# EAGLE design v7-flex2811_long (EAGLE 7.3.0)

## Sheet 1 of 20
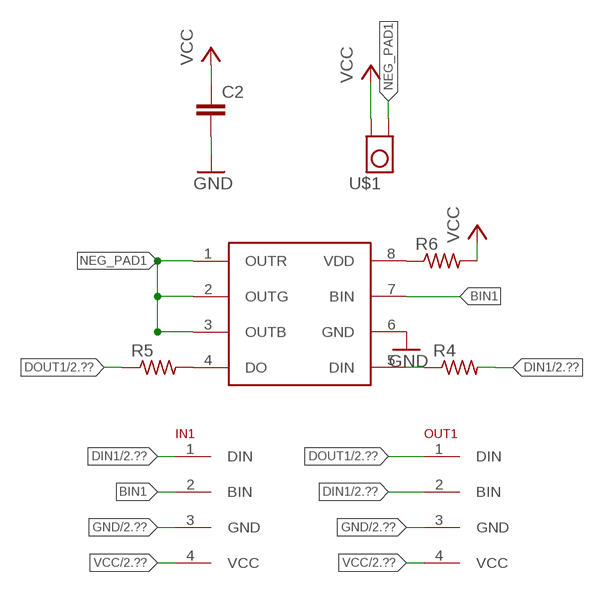
[diagram p0: schematic, sheet 1]

### Parts
C2  C-EUC0201  [C0201]
IN1  4PAD  [4PAD]
OUT1  4PAD  [4PAD]
R4  R-US_R0201  [R0201]
R5  R-US_R0201  [R0201]
R6  R-US_R0201  [R0201]
U$1  TP_4MM_MED_PAD  [TP_4MM_MED_PAD]
U$2  WS2818  [SO08]

### Nets
BIN1: IN1.2(BIN) U$2.7(BIN)
DIN1: IN1.1(DIN) OUT1.2(BIN) R4.2 ; also sheet 2
DOUT1: OUT1.1(DIN) R5.1 ; also sheet 2,3
GND: C2.2 IN1.3(GND) OUT1.3(GND) U$2.6(GND) ; also sheet 2,3,4,5,6,7,8,9,10,11,12,13,14,15,16,17,18,19,20
N$4: R4.1 U$2.5(DIN)
N$5: R5.2 U$2.4(DO)
N$6: R6.1 U$2.8(VDD)
NEG_PAD1: U$1.P$1 U$2.1(OUTR) U$2.2(OUTG) U$2.3(OUTB)
VCC: C2.1 IN1.4(VCC) OUT1.4(VCC) R6.2 U$1.P$2 ; also sheet 2,3,4,5,6,7,8,9,10,11,12,13,14,15,16,17,18,19,20

## Sheet 2 of 20
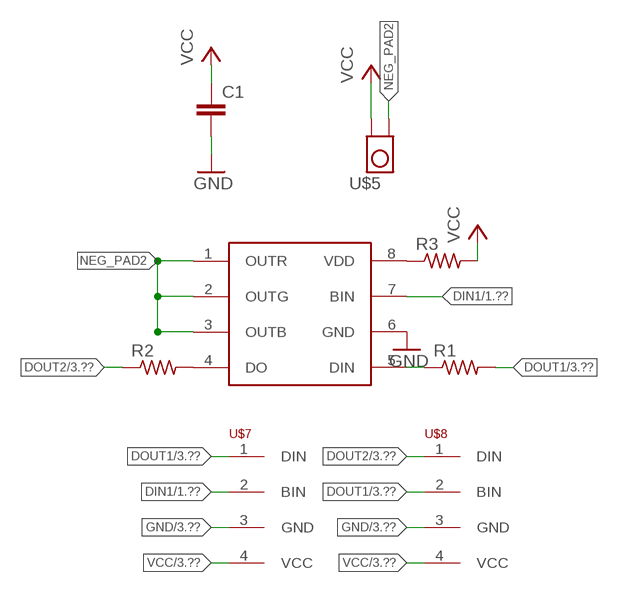
[diagram p1: schematic, sheet 2]

### Parts
C1  C-EUC0201  [C0201]
R1  R-US_R0201  [R0201]
R2  R-US_R0201  [R0201]
R3  R-US_R0201  [R0201]
U$5  TP_4MM_MED_PAD  [TP_4MM_MED_PAD]
U$6  WS2818  [SO08]
U$7  4PAD  [4PAD]
U$8  4PAD  [4PAD]

### Nets
DIN1: U$6.7(BIN) U$7.2(BIN) ; also sheet 1
DOUT1: R1.2 U$7.1(DIN) U$8.2(BIN) ; also sheet 1,3
DOUT2: R2.1 U$8.1(DIN) ; also sheet 3,4
GND: C1.2 U$6.6(GND) U$7.3(GND) U$8.3(GND) ; also sheet 1,3,4,5,6,7,8,9,10,11,12,13,14,15,16,17,18,19,20
N$1: R1.1 U$6.5(DIN)
N$2: R2.2 U$6.4(DO)
N$3: R3.1 U$6.8(VDD)
NEG_PAD2: U$5.P$1 U$6.1(OUTR) U$6.2(OUTG) U$6.3(OUTB)
VCC: C1.1 R3.2 U$5.P$2 U$7.4(VCC) U$8.4(VCC) ; also sheet 1,3,4,5,6,7,8,9,10,11,12,13,14,15,16,17,18,19,20

## Sheet 3 of 20
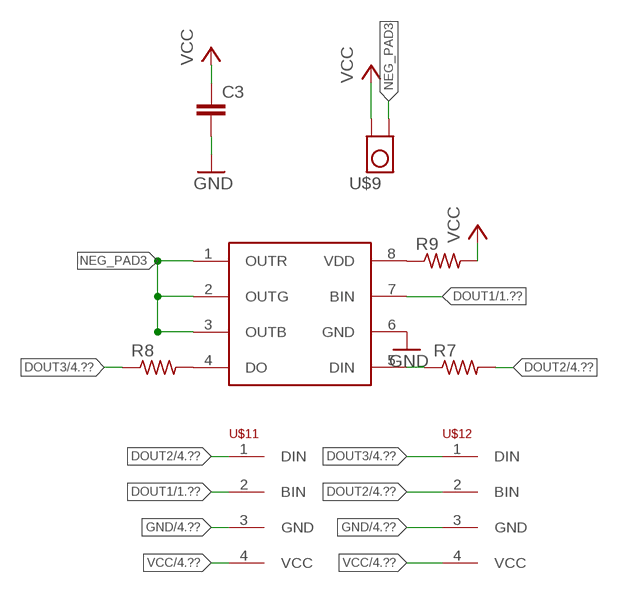
[diagram p2: schematic, sheet 3]

### Parts
C3  C-EUC0201  [C0201]
R7  R-US_R0201  [R0201]
R8  R-US_R0201  [R0201]
R9  R-US_R0201  [R0201]
U$9  TP_4MM_MED_PAD  [TP_4MM_MED_PAD]
U$10  WS2818  [SO08]
U$11  4PAD  [4PAD]
U$12  4PAD  [4PAD]

### Nets
DOUT1: U$10.7(BIN) U$11.2(BIN) ; also sheet 1,2
DOUT2: R7.2 U$11.1(DIN) U$12.2(BIN) ; also sheet 2,4
DOUT3: R8.1 U$12.1(DIN) ; also sheet 4,5
GND: C3.2 U$10.6(GND) U$11.3(GND) U$12.3(GND) ; also sheet 1,2,4,5,6,7,8,9,10,11,12,13,14,15,16,17,18,19,20
N$7: R7.1 U$10.5(DIN)
N$8: R8.2 U$10.4(DO)
N$9: R9.1 U$10.8(VDD)
NEG_PAD3: U$9.P$1 U$10.1(OUTR) U$10.2(OUTG) U$10.3(OUTB)
VCC: C3.1 R9.2 U$9.P$2 U$11.4(VCC) U$12.4(VCC) ; also sheet 1,2,4,5,6,7,8,9,10,11,12,13,14,15,16,17,18,19,20

## Sheet 4 of 20
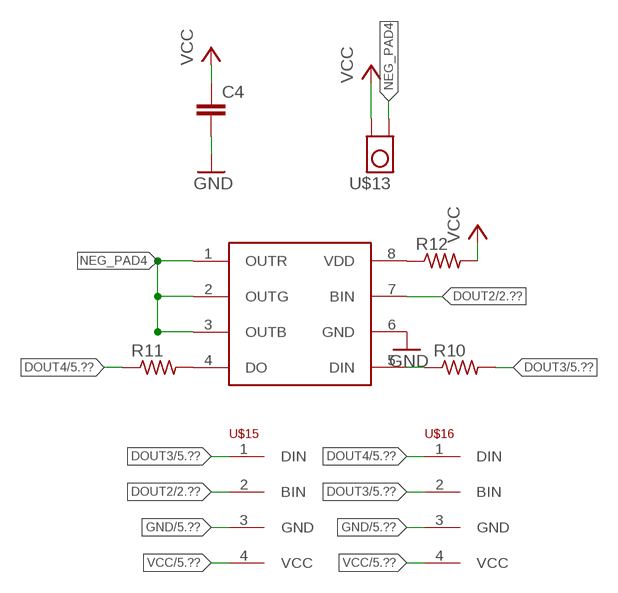
[diagram p3: schematic, sheet 4]

### Parts
C4  C-EUC0201  [C0201]
R10  R-US_R0201  [R0201]
R11  R-US_R0201  [R0201]
R12  R-US_R0201  [R0201]
U$13  TP_4MM_MED_PAD  [TP_4MM_MED_PAD]
U$14  WS2818  [SO08]
U$15  4PAD  [4PAD]
U$16  4PAD  [4PAD]

### Nets
DOUT2: U$14.7(BIN) U$15.2(BIN) ; also sheet 2,3
DOUT3: R10.2 U$15.1(DIN) U$16.2(BIN) ; also sheet 3,5
DOUT4: R11.1 U$16.1(DIN) ; also sheet 5,6
GND: C4.2 U$14.6(GND) U$15.3(GND) U$16.3(GND) ; also sheet 1,2,3,5,6,7,8,9,10,11,12,13,14,15,16,17,18,19,20
N$10: R10.1 U$14.5(DIN)
N$11: R11.2 U$14.4(DO)
N$12: R12.1 U$14.8(VDD)
NEG_PAD4: U$13.P$1 U$14.1(OUTR) U$14.2(OUTG) U$14.3(OUTB)
VCC: C4.1 R12.2 U$13.P$2 U$15.4(VCC) U$16.4(VCC) ; also sheet 1,2,3,5,6,7,8,9,10,11,12,13,14,15,16,17,18,19,20

## Sheet 5 of 20
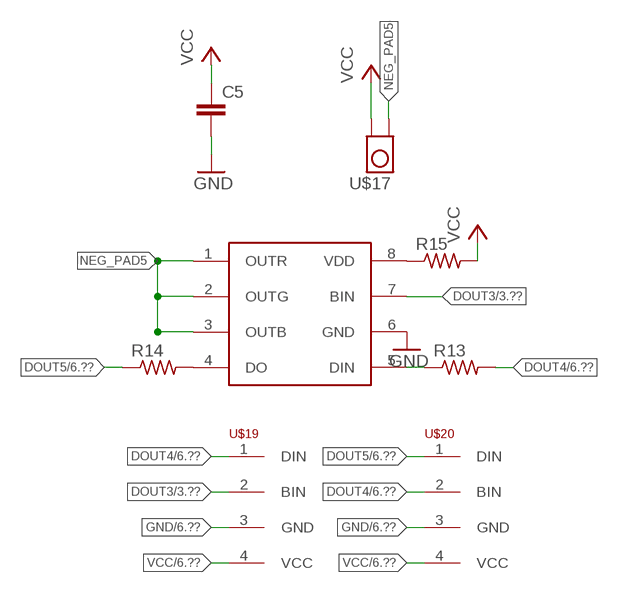
[diagram p4: schematic, sheet 5]

### Parts
C5  C-EUC0201  [C0201]
R13  R-US_R0201  [R0201]
R14  R-US_R0201  [R0201]
R15  R-US_R0201  [R0201]
U$17  TP_4MM_MED_PAD  [TP_4MM_MED_PAD]
U$18  WS2818  [SO08]
U$19  4PAD  [4PAD]
U$20  4PAD  [4PAD]

### Nets
DOUT3: U$18.7(BIN) U$19.2(BIN) ; also sheet 3,4
DOUT4: R13.2 U$19.1(DIN) U$20.2(BIN) ; also sheet 4,6
DOUT5: R14.1 U$20.1(DIN) ; also sheet 6,7
GND: C5.2 U$18.6(GND) U$19.3(GND) U$20.3(GND) ; also sheet 1,2,3,4,6,7,8,9,10,11,12,13,14,15,16,17,18,19,20
N$13: R13.1 U$18.5(DIN)
N$14: R14.2 U$18.4(DO)
N$15: R15.1 U$18.8(VDD)
NEG_PAD5: U$17.P$1 U$18.1(OUTR) U$18.2(OUTG) U$18.3(OUTB)
VCC: C5.1 R15.2 U$17.P$2 U$19.4(VCC) U$20.4(VCC) ; also sheet 1,2,3,4,6,7,8,9,10,11,12,13,14,15,16,17,18,19,20

## Sheet 6 of 20
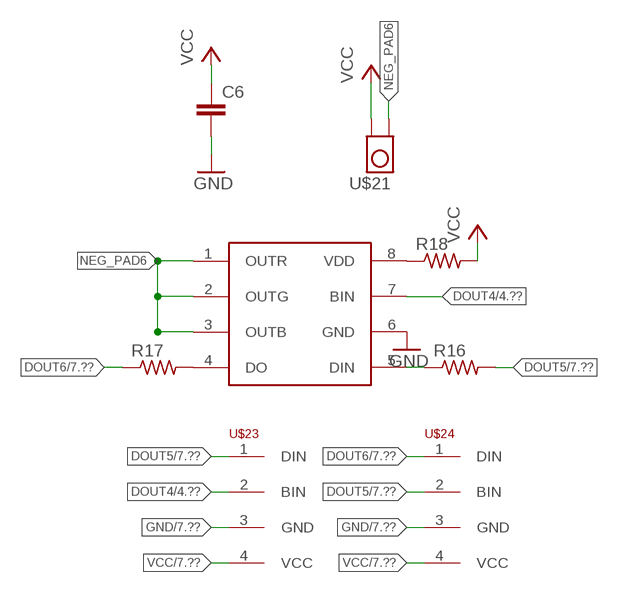
[diagram p5: schematic, sheet 6]

### Parts
C6  C-EUC0201  [C0201]
R16  R-US_R0201  [R0201]
R17  R-US_R0201  [R0201]
R18  R-US_R0201  [R0201]
U$21  TP_4MM_MED_PAD  [TP_4MM_MED_PAD]
U$22  WS2818  [SO08]
U$23  4PAD  [4PAD]
U$24  4PAD  [4PAD]

### Nets
DOUT4: U$22.7(BIN) U$23.2(BIN) ; also sheet 4,5
DOUT5: R16.2 U$23.1(DIN) U$24.2(BIN) ; also sheet 5,7
DOUT6: R17.1 U$24.1(DIN) ; also sheet 7,8
GND: C6.2 U$22.6(GND) U$23.3(GND) U$24.3(GND) ; also sheet 1,2,3,4,5,7,8,9,10,11,12,13,14,15,16,17,18,19,20
N$16: R16.1 U$22.5(DIN)
N$17: R17.2 U$22.4(DO)
N$18: R18.1 U$22.8(VDD)
NEG_PAD6: U$21.P$1 U$22.1(OUTR) U$22.2(OUTG) U$22.3(OUTB)
VCC: C6.1 R18.2 U$21.P$2 U$23.4(VCC) U$24.4(VCC) ; also sheet 1,2,3,4,5,7,8,9,10,11,12,13,14,15,16,17,18,19,20

## Sheet 7 of 20
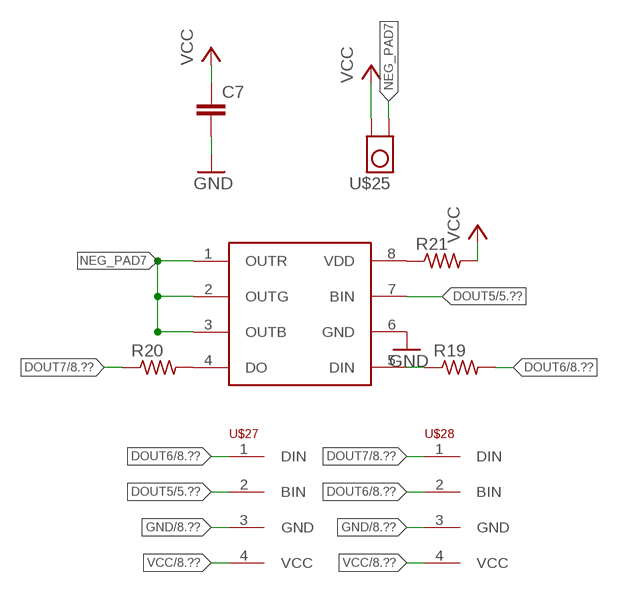
[diagram p6: schematic, sheet 7]

### Parts
C7  C-EUC0201  [C0201]
R19  R-US_R0201  [R0201]
R20  R-US_R0201  [R0201]
R21  R-US_R0201  [R0201]
U$25  TP_4MM_MED_PAD  [TP_4MM_MED_PAD]
U$26  WS2818  [SO08]
U$27  4PAD  [4PAD]
U$28  4PAD  [4PAD]

### Nets
DOUT5: U$26.7(BIN) U$27.2(BIN) ; also sheet 5,6
DOUT6: R19.2 U$27.1(DIN) U$28.2(BIN) ; also sheet 6,8
DOUT7: R20.1 U$28.1(DIN) ; also sheet 8,9
GND: C7.2 U$26.6(GND) U$27.3(GND) U$28.3(GND) ; also sheet 1,2,3,4,5,6,8,9,10,11,12,13,14,15,16,17,18,19,20
N$19: R19.1 U$26.5(DIN)
N$20: R20.2 U$26.4(DO)
N$21: R21.1 U$26.8(VDD)
NEG_PAD7: U$25.P$1 U$26.1(OUTR) U$26.2(OUTG) U$26.3(OUTB)
VCC: C7.1 R21.2 U$25.P$2 U$27.4(VCC) U$28.4(VCC) ; also sheet 1,2,3,4,5,6,8,9,10,11,12,13,14,15,16,17,18,19,20

## Sheet 8 of 20
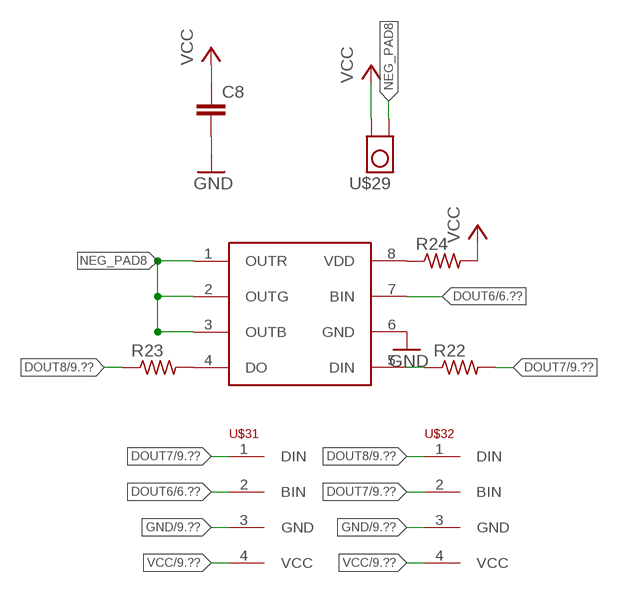
[diagram p7: schematic, sheet 8]

### Parts
C8  C-EUC0201  [C0201]
R22  R-US_R0201  [R0201]
R23  R-US_R0201  [R0201]
R24  R-US_R0201  [R0201]
U$29  TP_4MM_MED_PAD  [TP_4MM_MED_PAD]
U$30  WS2818  [SO08]
U$31  4PAD  [4PAD]
U$32  4PAD  [4PAD]

### Nets
DOUT6: U$30.7(BIN) U$31.2(BIN) ; also sheet 6,7
DOUT7: R22.2 U$31.1(DIN) U$32.2(BIN) ; also sheet 7,9
DOUT8: R23.1 U$32.1(DIN) ; also sheet 9,10
GND: C8.2 U$30.6(GND) U$31.3(GND) U$32.3(GND) ; also sheet 1,2,3,4,5,6,7,9,10,11,12,13,14,15,16,17,18,19,20
N$22: R22.1 U$30.5(DIN)
N$23: R23.2 U$30.4(DO)
N$24: R24.1 U$30.8(VDD)
NEG_PAD8: U$29.P$1 U$30.1(OUTR) U$30.2(OUTG) U$30.3(OUTB)
VCC: C8.1 R24.2 U$29.P$2 U$31.4(VCC) U$32.4(VCC) ; also sheet 1,2,3,4,5,6,7,9,10,11,12,13,14,15,16,17,18,19,20

## Sheet 9 of 20
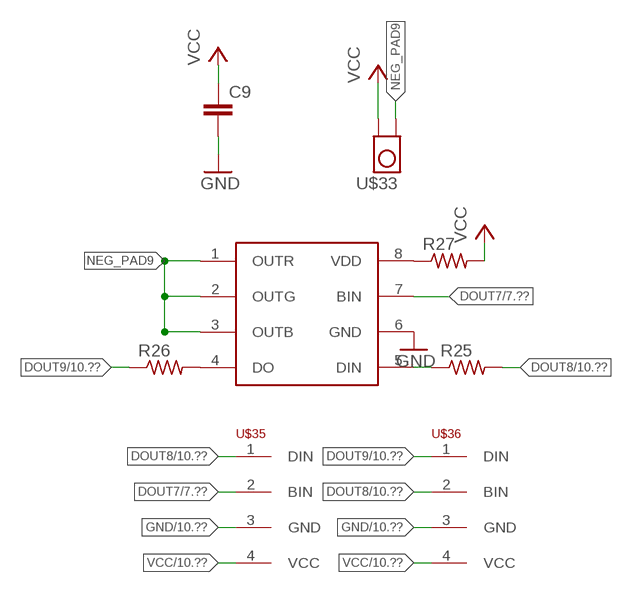
[diagram p8: schematic, sheet 9]

### Parts
C9  C-EUC0201  [C0201]
R25  R-US_R0201  [R0201]
R26  R-US_R0201  [R0201]
R27  R-US_R0201  [R0201]
U$33  TP_4MM_MED_PAD  [TP_4MM_MED_PAD]
U$34  WS2818  [SO08]
U$35  4PAD  [4PAD]
U$36  4PAD  [4PAD]

### Nets
DOUT7: U$34.7(BIN) U$35.2(BIN) ; also sheet 7,8
DOUT8: R25.2 U$35.1(DIN) U$36.2(BIN) ; also sheet 8,10
DOUT9: R26.1 U$36.1(DIN) ; also sheet 10,11
GND: C9.2 U$34.6(GND) U$35.3(GND) U$36.3(GND) ; also sheet 1,2,3,4,5,6,7,8,10,11,12,13,14,15,16,17,18,19,20
N$25: R25.1 U$34.5(DIN)
N$26: R26.2 U$34.4(DO)
N$27: R27.1 U$34.8(VDD)
NEG_PAD9: U$33.P$1 U$34.1(OUTR) U$34.2(OUTG) U$34.3(OUTB)
VCC: C9.1 R27.2 U$33.P$2 U$35.4(VCC) U$36.4(VCC) ; also sheet 1,2,3,4,5,6,7,8,10,11,12,13,14,15,16,17,18,19,20

## Sheet 10 of 20
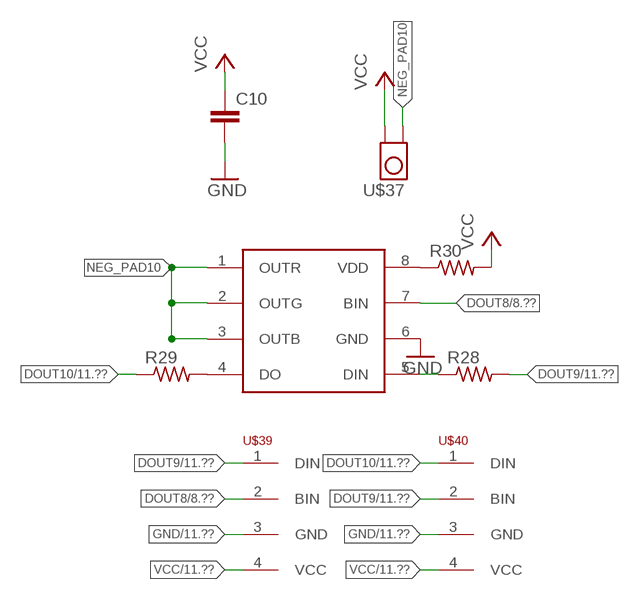
[diagram p9: schematic, sheet 10]

### Parts
C10  C-EUC0201  [C0201]
R28  R-US_R0201  [R0201]
R29  R-US_R0201  [R0201]
R30  R-US_R0201  [R0201]
U$37  TP_4MM_MED_PAD  [TP_4MM_MED_PAD]
U$38  WS2818  [SO08]
U$39  4PAD  [4PAD]
U$40  4PAD  [4PAD]

### Nets
DOUT8: U$38.7(BIN) U$39.2(BIN) ; also sheet 8,9
DOUT9: R28.2 U$39.1(DIN) U$40.2(BIN) ; also sheet 9,11
DOUT10: R29.1 U$40.1(DIN) ; also sheet 11,12
GND: C10.2 U$38.6(GND) U$39.3(GND) U$40.3(GND) ; also sheet 1,2,3,4,5,6,7,8,9,11,12,13,14,15,16,17,18,19,20
N$28: R28.1 U$38.5(DIN)
N$29: R29.2 U$38.4(DO)
N$30: R30.1 U$38.8(VDD)
NEG_PAD10: U$37.P$1 U$38.1(OUTR) U$38.2(OUTG) U$38.3(OUTB)
VCC: C10.1 R30.2 U$37.P$2 U$39.4(VCC) U$40.4(VCC) ; also sheet 1,2,3,4,5,6,7,8,9,11,12,13,14,15,16,17,18,19,20

## Sheet 11 of 20
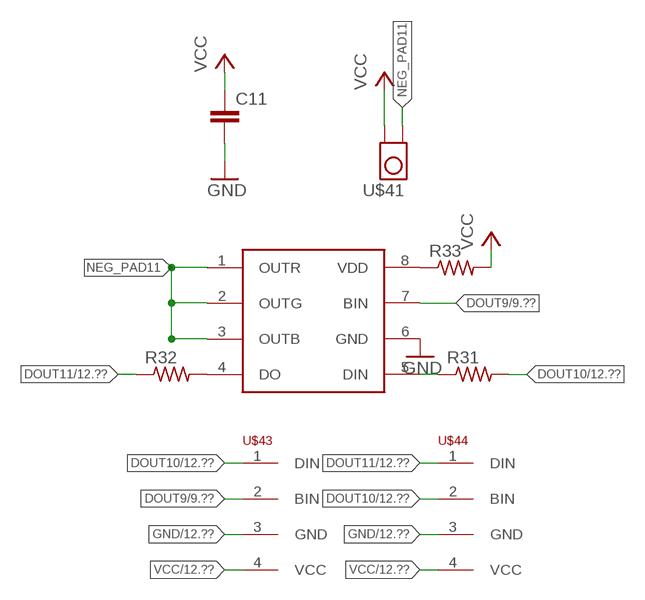
[diagram p10: schematic, sheet 11]

### Parts
C11  C-EUC0201  [C0201]
R31  R-US_R0201  [R0201]
R32  R-US_R0201  [R0201]
R33  R-US_R0201  [R0201]
U$41  TP_4MM_MED_PAD  [TP_4MM_MED_PAD]
U$42  WS2818  [SO08]
U$43  4PAD  [4PAD]
U$44  4PAD  [4PAD]

### Nets
DOUT9: U$42.7(BIN) U$43.2(BIN) ; also sheet 9,10
DOUT10: R31.2 U$43.1(DIN) U$44.2(BIN) ; also sheet 10,12
DOUT11: R32.1 U$44.1(DIN) ; also sheet 12,13
GND: C11.2 U$42.6(GND) U$43.3(GND) U$44.3(GND) ; also sheet 1,2,3,4,5,6,7,8,9,10,12,13,14,15,16,17,18,19,20
N$31: R31.1 U$42.5(DIN)
N$32: R32.2 U$42.4(DO)
N$33: R33.1 U$42.8(VDD)
NEG_PAD11: U$41.P$1 U$42.1(OUTR) U$42.2(OUTG) U$42.3(OUTB)
VCC: C11.1 R33.2 U$41.P$2 U$43.4(VCC) U$44.4(VCC) ; also sheet 1,2,3,4,5,6,7,8,9,10,12,13,14,15,16,17,18,19,20

## Sheet 12 of 20
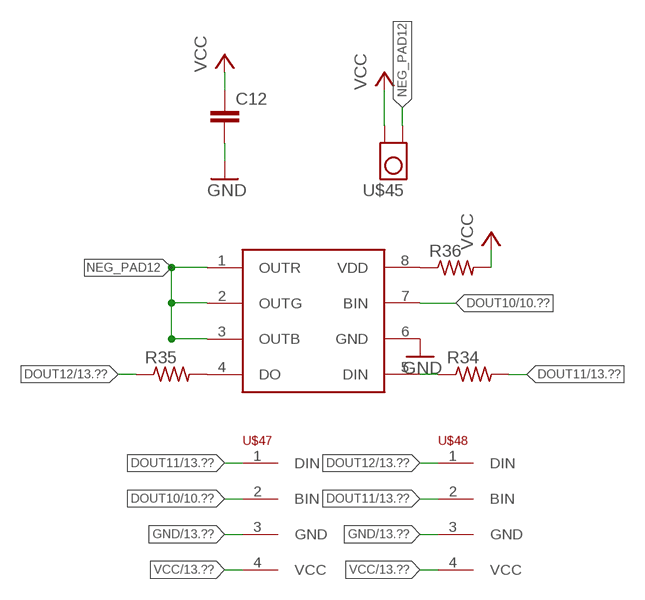
[diagram p11: schematic, sheet 12]

### Parts
C12  C-EUC0201  [C0201]
R34  R-US_R0201  [R0201]
R35  R-US_R0201  [R0201]
R36  R-US_R0201  [R0201]
U$45  TP_4MM_MED_PAD  [TP_4MM_MED_PAD]
U$46  WS2818  [SO08]
U$47  4PAD  [4PAD]
U$48  4PAD  [4PAD]

### Nets
DOUT10: U$46.7(BIN) U$47.2(BIN) ; also sheet 10,11
DOUT11: R34.2 U$47.1(DIN) U$48.2(BIN) ; also sheet 11,13
DOUT12: R35.1 U$48.1(DIN) ; also sheet 13,14
GND: C12.2 U$46.6(GND) U$47.3(GND) U$48.3(GND) ; also sheet 1,2,3,4,5,6,7,8,9,10,11,13,14,15,16,17,18,19,20
N$34: R34.1 U$46.5(DIN)
N$35: R35.2 U$46.4(DO)
N$36: R36.1 U$46.8(VDD)
NEG_PAD12: U$45.P$1 U$46.1(OUTR) U$46.2(OUTG) U$46.3(OUTB)
VCC: C12.1 R36.2 U$45.P$2 U$47.4(VCC) U$48.4(VCC) ; also sheet 1,2,3,4,5,6,7,8,9,10,11,13,14,15,16,17,18,19,20

## Sheet 13 of 20
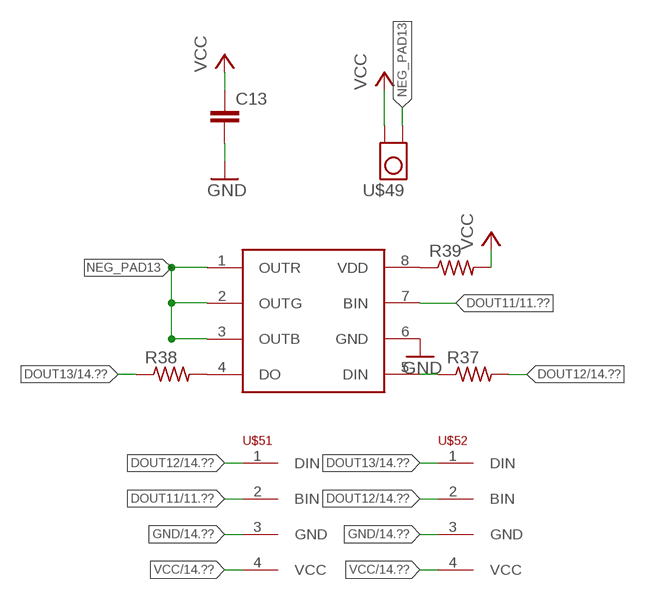
[diagram p12: schematic, sheet 13]

### Parts
C13  C-EUC0201  [C0201]
R37  R-US_R0201  [R0201]
R38  R-US_R0201  [R0201]
R39  R-US_R0201  [R0201]
U$49  TP_4MM_MED_PAD  [TP_4MM_MED_PAD]
U$50  WS2818  [SO08]
U$51  4PAD  [4PAD]
U$52  4PAD  [4PAD]

### Nets
DOUT11: U$50.7(BIN) U$51.2(BIN) ; also sheet 11,12
DOUT12: R37.2 U$51.1(DIN) U$52.2(BIN) ; also sheet 12,14
DOUT13: R38.1 U$52.1(DIN) ; also sheet 14,15
GND: C13.2 U$50.6(GND) U$51.3(GND) U$52.3(GND) ; also sheet 1,2,3,4,5,6,7,8,9,10,11,12,14,15,16,17,18,19,20
N$37: R37.1 U$50.5(DIN)
N$38: R38.2 U$50.4(DO)
N$39: R39.1 U$50.8(VDD)
NEG_PAD13: U$49.P$1 U$50.1(OUTR) U$50.2(OUTG) U$50.3(OUTB)
VCC: C13.1 R39.2 U$49.P$2 U$51.4(VCC) U$52.4(VCC) ; also sheet 1,2,3,4,5,6,7,8,9,10,11,12,14,15,16,17,18,19,20

## Sheet 14 of 20
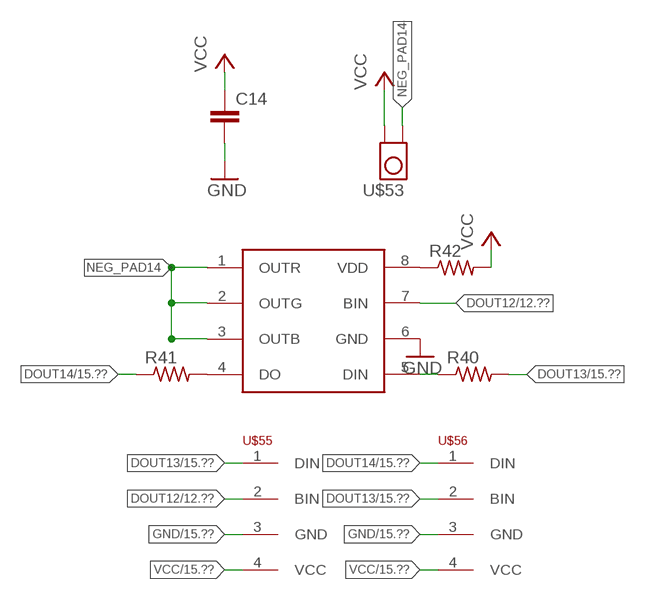
[diagram p13: schematic, sheet 14]

### Parts
C14  C-EUC0201  [C0201]
R40  R-US_R0201  [R0201]
R41  R-US_R0201  [R0201]
R42  R-US_R0201  [R0201]
U$53  TP_4MM_MED_PAD  [TP_4MM_MED_PAD]
U$54  WS2818  [SO08]
U$55  4PAD  [4PAD]
U$56  4PAD  [4PAD]

### Nets
DOUT12: U$54.7(BIN) U$55.2(BIN) ; also sheet 12,13
DOUT13: R40.2 U$55.1(DIN) U$56.2(BIN) ; also sheet 13,15
DOUT14: R41.1 U$56.1(DIN) ; also sheet 15,16
GND: C14.2 U$54.6(GND) U$55.3(GND) U$56.3(GND) ; also sheet 1,2,3,4,5,6,7,8,9,10,11,12,13,15,16,17,18,19,20
N$40: R40.1 U$54.5(DIN)
N$41: R41.2 U$54.4(DO)
N$42: R42.1 U$54.8(VDD)
NEG_PAD14: U$53.P$1 U$54.1(OUTR) U$54.2(OUTG) U$54.3(OUTB)
VCC: C14.1 R42.2 U$53.P$2 U$55.4(VCC) U$56.4(VCC) ; also sheet 1,2,3,4,5,6,7,8,9,10,11,12,13,15,16,17,18,19,20

## Sheet 15 of 20
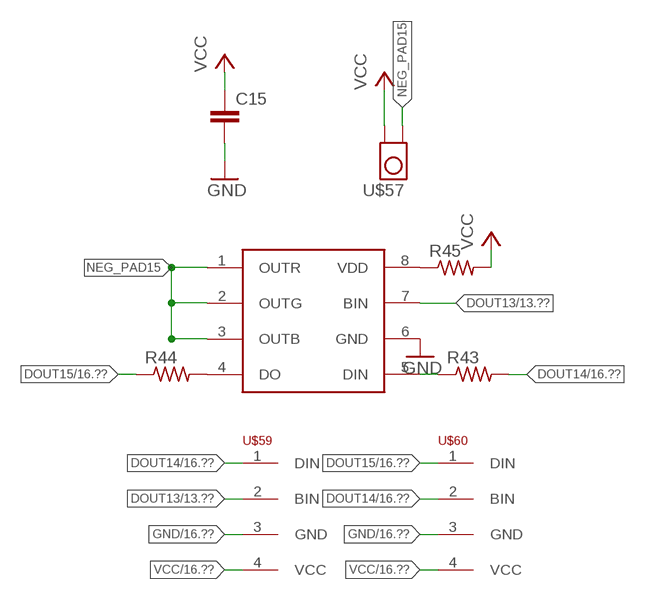
[diagram p14: schematic, sheet 15]

### Parts
C15  C-EUC0201  [C0201]
R43  R-US_R0201  [R0201]
R44  R-US_R0201  [R0201]
R45  R-US_R0201  [R0201]
U$57  TP_4MM_MED_PAD  [TP_4MM_MED_PAD]
U$58  WS2818  [SO08]
U$59  4PAD  [4PAD]
U$60  4PAD  [4PAD]

### Nets
DOUT13: U$58.7(BIN) U$59.2(BIN) ; also sheet 13,14
DOUT14: R43.2 U$59.1(DIN) U$60.2(BIN) ; also sheet 14,16
DOUT15: R44.1 U$60.1(DIN) ; also sheet 16,17
GND: C15.2 U$58.6(GND) U$59.3(GND) U$60.3(GND) ; also sheet 1,2,3,4,5,6,7,8,9,10,11,12,13,14,16,17,18,19,20
N$43: R43.1 U$58.5(DIN)
N$44: R44.2 U$58.4(DO)
N$45: R45.1 U$58.8(VDD)
NEG_PAD15: U$57.P$1 U$58.1(OUTR) U$58.2(OUTG) U$58.3(OUTB)
VCC: C15.1 R45.2 U$57.P$2 U$59.4(VCC) U$60.4(VCC) ; also sheet 1,2,3,4,5,6,7,8,9,10,11,12,13,14,16,17,18,19,20

## Sheet 16 of 20
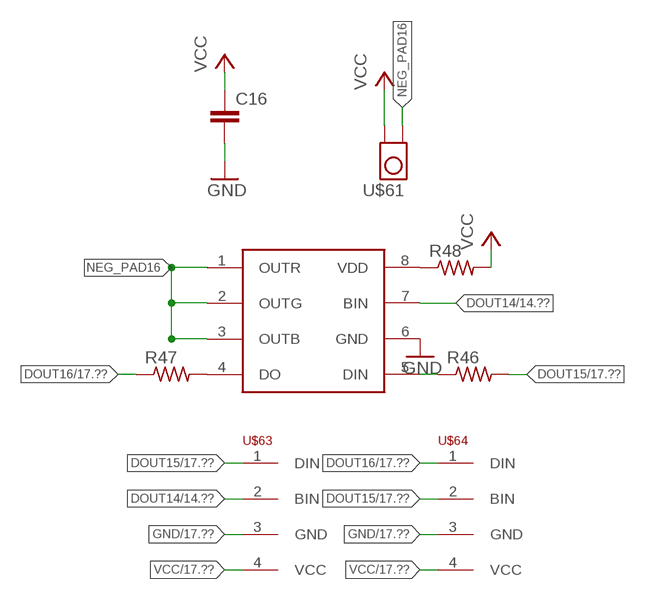
[diagram p15: schematic, sheet 16]

### Parts
C16  C-EUC0201  [C0201]
R46  R-US_R0201  [R0201]
R47  R-US_R0201  [R0201]
R48  R-US_R0201  [R0201]
U$61  TP_4MM_MED_PAD  [TP_4MM_MED_PAD]
U$62  WS2818  [SO08]
U$63  4PAD  [4PAD]
U$64  4PAD  [4PAD]

### Nets
DOUT14: U$62.7(BIN) U$63.2(BIN) ; also sheet 14,15
DOUT15: R46.2 U$63.1(DIN) U$64.2(BIN) ; also sheet 15,17
DOUT16: R47.1 U$64.1(DIN) ; also sheet 17,18
GND: C16.2 U$62.6(GND) U$63.3(GND) U$64.3(GND) ; also sheet 1,2,3,4,5,6,7,8,9,10,11,12,13,14,15,17,18,19,20
N$46: R46.1 U$62.5(DIN)
N$47: R47.2 U$62.4(DO)
N$48: R48.1 U$62.8(VDD)
NEG_PAD16: U$61.P$1 U$62.1(OUTR) U$62.2(OUTG) U$62.3(OUTB)
VCC: C16.1 R48.2 U$61.P$2 U$63.4(VCC) U$64.4(VCC) ; also sheet 1,2,3,4,5,6,7,8,9,10,11,12,13,14,15,17,18,19,20

## Sheet 17 of 20
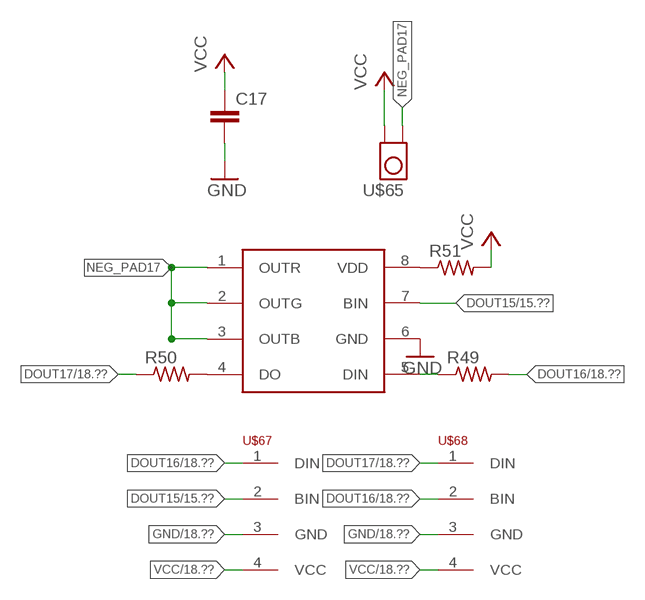
[diagram p16: schematic, sheet 17]

### Parts
C17  C-EUC0201  [C0201]
R49  R-US_R0201  [R0201]
R50  R-US_R0201  [R0201]
R51  R-US_R0201  [R0201]
U$65  TP_4MM_MED_PAD  [TP_4MM_MED_PAD]
U$66  WS2818  [SO08]
U$67  4PAD  [4PAD]
U$68  4PAD  [4PAD]

### Nets
DOUT15: U$66.7(BIN) U$67.2(BIN) ; also sheet 15,16
DOUT16: R49.2 U$67.1(DIN) U$68.2(BIN) ; also sheet 16,18
DOUT17: R50.1 U$68.1(DIN) ; also sheet 18,19
GND: C17.2 U$66.6(GND) U$67.3(GND) U$68.3(GND) ; also sheet 1,2,3,4,5,6,7,8,9,10,11,12,13,14,15,16,18,19,20
N$49: R49.1 U$66.5(DIN)
N$50: R50.2 U$66.4(DO)
N$51: R51.1 U$66.8(VDD)
NEG_PAD17: U$65.P$1 U$66.1(OUTR) U$66.2(OUTG) U$66.3(OUTB)
VCC: C17.1 R51.2 U$65.P$2 U$67.4(VCC) U$68.4(VCC) ; also sheet 1,2,3,4,5,6,7,8,9,10,11,12,13,14,15,16,18,19,20

## Sheet 18 of 20
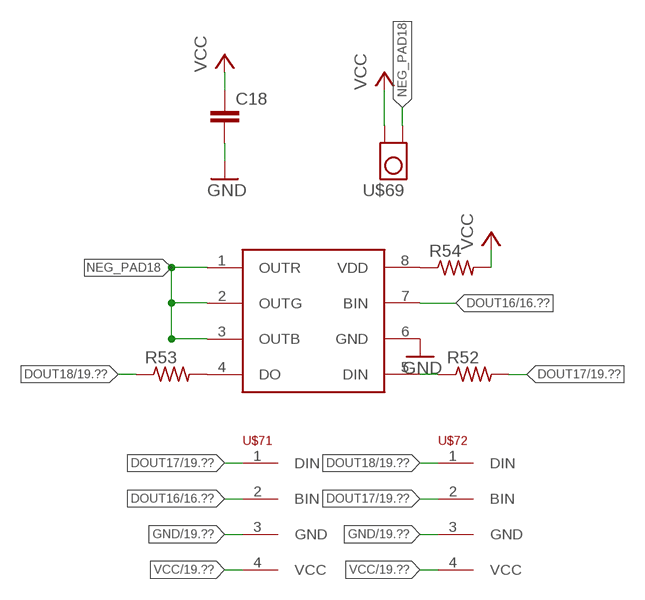
[diagram p17: schematic, sheet 18]

### Parts
C18  C-EUC0201  [C0201]
R52  R-US_R0201  [R0201]
R53  R-US_R0201  [R0201]
R54  R-US_R0201  [R0201]
U$69  TP_4MM_MED_PAD  [TP_4MM_MED_PAD]
U$70  WS2818  [SO08]
U$71  4PAD  [4PAD]
U$72  4PAD  [4PAD]

### Nets
DOUT16: U$70.7(BIN) U$71.2(BIN) ; also sheet 16,17
DOUT17: R52.2 U$71.1(DIN) U$72.2(BIN) ; also sheet 17,19
DOUT18: R53.1 U$72.1(DIN) ; also sheet 19,20
GND: C18.2 U$70.6(GND) U$71.3(GND) U$72.3(GND) ; also sheet 1,2,3,4,5,6,7,8,9,10,11,12,13,14,15,16,17,19,20
N$52: R52.1 U$70.5(DIN)
N$53: R53.2 U$70.4(DO)
N$54: R54.1 U$70.8(VDD)
NEG_PAD18: U$69.P$1 U$70.1(OUTR) U$70.2(OUTG) U$70.3(OUTB)
VCC: C18.1 R54.2 U$69.P$2 U$71.4(VCC) U$72.4(VCC) ; also sheet 1,2,3,4,5,6,7,8,9,10,11,12,13,14,15,16,17,19,20

## Sheet 19 of 20
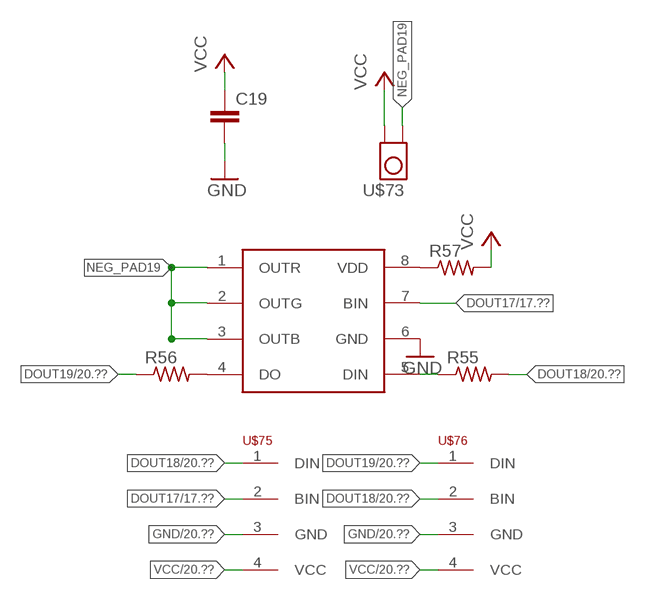
[diagram p18: schematic, sheet 19]

### Parts
C19  C-EUC0201  [C0201]
R55  R-US_R0201  [R0201]
R56  R-US_R0201  [R0201]
R57  R-US_R0201  [R0201]
U$73  TP_4MM_MED_PAD  [TP_4MM_MED_PAD]
U$74  WS2818  [SO08]
U$75  4PAD  [4PAD]
U$76  4PAD  [4PAD]

### Nets
DOUT17: U$74.7(BIN) U$75.2(BIN) ; also sheet 17,18
DOUT18: R55.2 U$75.1(DIN) U$76.2(BIN) ; also sheet 18,20
DOUT19: R56.1 U$76.1(DIN) ; also sheet 20
GND: C19.2 U$74.6(GND) U$75.3(GND) U$76.3(GND) ; also sheet 1,2,3,4,5,6,7,8,9,10,11,12,13,14,15,16,17,18,20
N$55: R55.1 U$74.5(DIN)
N$56: R56.2 U$74.4(DO)
N$57: R57.1 U$74.8(VDD)
NEG_PAD19: U$73.P$1 U$74.1(OUTR) U$74.2(OUTG) U$74.3(OUTB)
VCC: C19.1 R57.2 U$73.P$2 U$75.4(VCC) U$76.4(VCC) ; also sheet 1,2,3,4,5,6,7,8,9,10,11,12,13,14,15,16,17,18,20

## Sheet 20 of 20
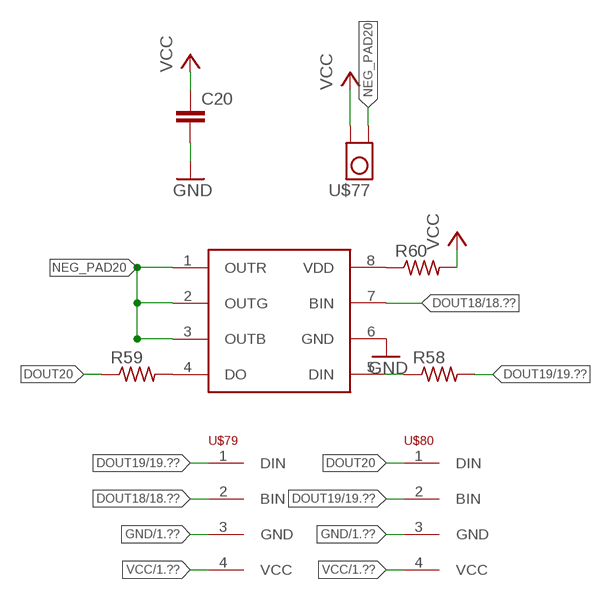
[diagram p19: schematic, sheet 20]

### Parts
C20  C-EUC0201  [C0201]
R58  R-US_R0201  [R0201]
R59  R-US_R0201  [R0201]
R60  R-US_R0201  [R0201]
U$77  TP_4MM_MED_PAD  [TP_4MM_MED_PAD]
U$78  WS2818  [SO08]
U$79  4PAD  [4PAD]
U$80  4PAD  [4PAD]

### Nets
DOUT18: U$78.7(BIN) U$79.2(BIN) ; also sheet 18,19
DOUT19: R58.2 U$79.1(DIN) U$80.2(BIN) ; also sheet 19
DOUT20: R59.1 U$80.1(DIN)
GND: C20.2 U$78.6(GND) U$79.3(GND) U$80.3(GND) ; also sheet 1,2,3,4,5,6,7,8,9,10,11,12,13,14,15,16,17,18,19
N$58: R58.1 U$78.5(DIN)
N$59: R59.2 U$78.4(DO)
N$60: R60.1 U$78.8(VDD)
NEG_PAD20: U$77.P$1 U$78.1(OUTR) U$78.2(OUTG) U$78.3(OUTB)
VCC: C20.1 R60.2 U$77.P$2 U$79.4(VCC) U$80.4(VCC) ; also sheet 1,2,3,4,5,6,7,8,9,10,11,12,13,14,15,16,17,18,19

## Library data of the parts
C1-C20 = rcl:C-EU: CAPACITOR, European symbol
IN1 OUT1 U$7 U$8 U$11 U$12 U$15 U$16 U$19 U$20 U$23 U$24 U$27 U$28 U$31 U$32 U$35 U$36 U$39 U$40 U$43 U$44 U$47 U$48 U$51 U$52 U$55 U$56 U$59 U$60 U$63 U$64 U$67 U$68 U$71 U$72 U$75 U$76 U$79 U$80 = Sparky:4PAD
R1-R60 = rcl:R-US_: RESISTOR, American symbol
U$1 U$5 U$9 U$13 U$17 U$21 U$25 U$29 U$33 U$37 U$41 U$45 U$49 U$53 U$57 U$61 U$65 U$69 U$73 U$77 = tom-tappytap-v5-flex:TP_4MM_MED_PAD
U$2 = Sparky:WS2818
U$6 U$10 U$14 U$18 U$22 U$26 U$30 U$34 U$38 U$42 U$46 U$50 U$54 U$58 U$62 U$66 U$70 U$74 U$78 = adafruit:WS2818

## Board
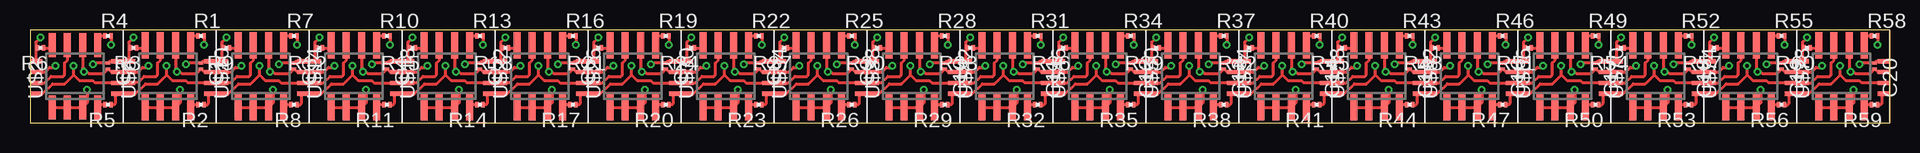
[diagram p20: board, top side]
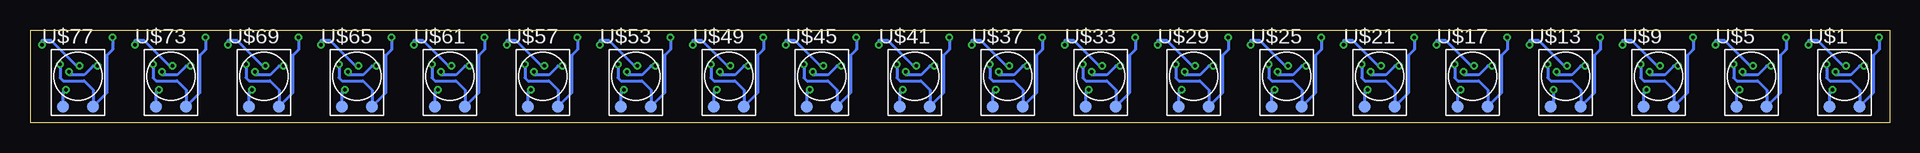
[diagram p21: board, bottom side, seen from below]

Size 155 x 7.75 mm. Coordinates in mm from the lower left corner, seen from the top.
Outline: 0,0 155,0 155,7.75 0,7.75 0,0
Copper layers (1*16): Top 0.035mm / dielectric 1.5mm / Bottom 0.035mm
Design rules "PCBWayMin *": minimum track width 6mil, minimum drill 0.3mm, track to track 6mil, track to pad 6mil, pad to pad 6mil, via to via 6mil, smd to smd 0mil, copper to edge 10mil, drill to drill 8mil, minimum pad ring 10mil, minimum via ring 6mil, stop-mask expansion 4mil, vias tented up to drill 25mil, thermal gap 10mil

### Footprints (pad centres in the part's own frame; a part is rotated, then mirrored left to right if it is on the bottom)
C0201 = smd 0.25 x 0.35: 1 -0.25,0; 2 0.25,0
4PAD = smd 1 x 0.4: 1 0,0.3 | smd 1 x 0.35: 2 0,1.2; 3 0,2.1; 4 0,3
R0201 = smd 0.28 x 0.43: 1 -0.255,0; 2 0.255,0
TP_4MM_MED_PAD = smd 1.016 x 1.016: P$1 -1.24,-2.55; P$2 1.24,-2.55
SO08 = smd 0.6 x 2: 1 -1.905,-2.6; 2 -0.635,-2.6; 3 0.635,-2.6; 4 1.905,-2.6; 5 1.905,2.6; 6 0.635,2.6; 7 -0.635,2.6; 8 -1.905,2.6
SO08' = smd 0.6 x 2.2: 1 -1.905,-2.6; 2 -0.635,-2.6; 3 0.635,-2.6; 4 1.905,-2.6; 5 1.905,2.6; 6 0.635,2.6; 7 -0.635,2.6; 8 -1.905,2.6

### Placement (x,y rotation side)
C1  14.25,4.75 270 top
C2  6.5,4.75 270 top
C3  22,4.75 270 top
C4  29.75,4.75 270 top
C5  37.5,4.75 270 top
C6  45.25,4.75 270 top
C7  53,4.75 270 top
C8  60.75,4.75 270 top
C9  68.5,4.75 270 top
C10  76.25,4.75 270 top
C11  84,4.75 270 top
C12  91.75,4.75 270 top
C13  99.5,4.75 270 top
C14  107.25,4.75 270 top
C15  115,4.75 270 top
C16  122.75,4.75 270 top
C17  130.5,4.75 270 top
C18  138.25,4.75 270 top
C19  146,4.75 270 top
C20  153.75,4.75 270 top
IN1  0.5,2.12 0 top
OUT1  7.25,2.12 0 top
R1  14.25,7.25 0 top
R2  14.25,1.5 180 top
R3  8.62,6.25 180 top
R4  6.5,7.25 0 top
R5  6.5,1.5 180 top
R6  0.88,6.25 180 top
R7  22,7.25 0 top
R8  22,1.5 180 top
R9  16.38,6.25 180 top
R10  29.75,7.25 0 top
R11  29.75,1.5 180 top
R12  24.12,6.25 180 top
R13  37.5,7.25 0 top
R14  37.5,1.5 180 top
R15  31.88,6.25 180 top
R16  45.25,7.25 0 top
R17  45.25,1.5 180 top
R18  39.62,6.25 180 top
R19  53,7.25 0 top
R20  53,1.5 180 top
R21  47.38,6.25 180 top
R22  60.75,7.25 0 top
R23  60.75,1.5 180 top
R24  55.12,6.25 180 top
R25  68.5,7.25 0 top
R26  68.5,1.5 180 top
R27  62.88,6.25 180 top
R28  76.25,7.25 0 top
R29  76.25,1.5 180 top
R30  70.62,6.25 180 top
R31  84,7.25 0 top
R32  84,1.5 180 top
R33  78.38,6.25 180 top
R34  91.75,7.25 0 top
R35  91.75,1.5 180 top
R36  86.12,6.25 180 top
R37  99.5,7.25 0 top
R38  99.5,1.5 180 top
R39  93.88,6.25 180 top
R40  107.25,7.25 0 top
R41  107.25,1.5 180 top
R42  101.62,6.25 180 top
R43  115,7.25 0 top
R44  115,1.5 180 top
R45  109.38,6.25 180 top
R46  122.75,7.25 0 top
R47  122.75,1.5 180 top
R48  117.12,6.25 180 top
R49  130.5,7.25 0 top
R50  130.5,1.5 180 top
R51  124.88,6.25 180 top
R52  138.25,7.25 0 top
R53  138.25,1.5 180 top
R54  132.62,6.25 180 top
R55  146,7.25 0 top
R56  146,1.5 180 top
R57  140.38,6.25 180 top
R58  153.75,7.25 0 top
R59  153.75,1.5 180 top
R60  148.12,6.25 180 top
U$1  3.75,3.88 0 bottom
U$2  3.75,3.88 0 top
U$5  11.5,3.88 0 bottom
U$6  WS2818  [SO08']  11.5,3.88 0 top
U$7  8.25,2.12 0 top
U$8  15,2.12 0 top
U$9  19.25,3.88 0 bottom
U$10  WS2818  [SO08']  19.25,3.88 0 top
U$11  16,2.12 0 top
U$12  22.75,2.12 0 top
U$13  27,3.88 0 bottom
U$14  WS2818  [SO08']  27,3.88 0 top
U$15  23.75,2.12 0 top
U$16  30.5,2.12 0 top
U$17  34.75,3.88 0 bottom
U$18  WS2818  [SO08']  34.75,3.88 0 top
U$19  31.5,2.12 0 top
U$20  38.25,2.12 0 top
U$21  42.5,3.88 0 bottom
U$22  WS2818  [SO08']  42.5,3.88 0 top
U$23  39.25,2.12 0 top
U$24  46,2.12 0 top
U$25  50.25,3.88 0 bottom
U$26  WS2818  [SO08']  50.25,3.88 0 top
U$27  47,2.12 0 top
U$28  53.75,2.12 0 top
U$29  58,3.88 0 bottom
U$30  WS2818  [SO08']  58,3.88 0 top
U$31  54.75,2.12 0 top
U$32  61.5,2.12 0 top
U$33  65.75,3.88 0 bottom
U$34  WS2818  [SO08']  65.75,3.88 0 top
U$35  62.5,2.12 0 top
U$36  69.25,2.12 0 top
U$37  73.5,3.88 0 bottom
U$38  WS2818  [SO08']  73.5,3.88 0 top
U$39  70.25,2.12 0 top
U$40  77,2.12 0 top
U$41  81.25,3.88 0 bottom
U$42  WS2818  [SO08']  81.25,3.88 0 top
U$43  78,2.12 0 top
U$44  84.75,2.12 0 top
U$45  89,3.88 0 bottom
U$46  WS2818  [SO08']  89,3.88 0 top
U$47  85.75,2.12 0 top
U$48  92.5,2.12 0 top
U$49  96.75,3.88 0 bottom
U$50  WS2818  [SO08']  96.75,3.88 0 top
U$51  93.5,2.12 0 top
U$52  100.25,2.12 0 top
U$53  104.5,3.88 0 bottom
U$54  WS2818  [SO08']  104.5,3.88 0 top
U$55  101.25,2.12 0 top
U$56  108,2.12 0 top
U$57  112.25,3.88 0 bottom
U$58  WS2818  [SO08']  112.25,3.88 0 top
U$59  109,2.12 0 top
U$60  115.75,2.12 0 top
U$61  120,3.88 0 bottom
U$62  WS2818  [SO08']  120,3.88 0 top
U$63  116.75,2.12 0 top
U$64  123.5,2.12 0 top
U$65  127.75,3.88 0 bottom
U$66  WS2818  [SO08']  127.75,3.88 0 top
U$67  124.5,2.12 0 top
U$68  131.25,2.12 0 top
U$69  135.5,3.88 0 bottom
U$70  WS2818  [SO08']  135.5,3.88 0 top
U$71  132.25,2.12 0 top
U$72  139,2.12 0 top
U$73  143.25,3.88 0 bottom
U$74  WS2818  [SO08']  143.25,3.88 0 top
U$75  140,2.12 0 top
U$76  146.75,2.12 0 top
U$77  151,3.88 0 bottom
U$78  WS2818  [SO08']  151,3.88 0 top
U$79  147.75,2.12 0 top
U$80  154.5,2.12 0 top

### Tracks (layer width: path | path; a pad name or v marks a point on that pad's centre or on a via)
BIN1
  Top 0.254: IN1.2 1.2,3.33 1.75,3.88 2.75,3.88 2.88,4 2.88,5 3.12,5.25 U$2.7
DIN1  (via drill 0.3)
  Top 0.254: 3.62,4 v3.62,4.75 | 3.62,4 2.88,3.25 1.88,3.25 1.05,2.42 IN1.1 | 3.62,4 4.12,3.5 5.25,3.5 5.42,3.33 OUT1.2 U$7.2 8.3,3.38 9,3.38 9.5,3.88 10.5,3.88 10.62,4 10.62,5 10.88,5.25 U$6.7 | R4.2 v6.75,6.5
  Bottom 0.254: v3.62,4.75 3.88,4.75 6,6.88 6.75,6.88 v6.75,6.5
DOUT1  (via drill 0.3)
  Top 0.254: 11.38,4 v11.38,4.75 | 11.38,4 10.62,3.25 9.62,3.25 8.8,2.42 U$7.1 OUT1.1 7.12,2.3 7.12,1.62 7,1.5 R5.1 | 11.38,4 11.88,3.5 13,3.5 13.18,3.33 U$8.2 U$11.2 16.7,3.33 17.25,3.88 18.25,3.88 18.38,4 18.38,5 18.62,5.25 18.62,6.46 U$10.7 | R1.2 v14.51,6.5 v14.5,6.5
  Bottom 0.254: v11.38,4.75 11.62,4.75 13.75,6.88 14.5,6.88 v14.5,6.5
DOUT2  (via drill 0.3)
  Top 0.254: R2.1 14.75,1.5 14.88,1.62 14.88,2.3 U$8.1 U$11.1 16.55,2.42 17.38,3.25 18.38,3.25 19.12,4 | 19.12,4 v19.12,4.75 | R7.2 v22.25,6.5 | 19.12,4 19.62,3.5 20.75,3.5 20.93,3.33 U$12.2 U$15.2 24.45,3.33 25,3.88 26,3.88 26.12,4 26.12,5 26.38,5.25 26.38,6.46 U$14.7
  Bottom 0.254: v19.12,4.75 19.38,4.75 21.5,6.88 22.25,6.88 v22.25,6.5
DOUT3  (via drill 0.3)
  Top 0.254: 26.88,4 v26.88,4.75 | 26.88,4 26.12,3.25 25.12,3.25 24.3,2.42 U$15.1 U$12.1 22.62,2.3 22.62,1.62 22.5,1.5 R8.1 | 26.88,4 27.38,3.5 28.5,3.5 28.68,3.33 U$16.2 U$19.2 32.2,3.33 32.75,3.88 33.75,3.88 33.88,4 33.88,5 34.12,5.25 U$18.7 | R10.2 v30,6.5
  Bottom 0.254: v26.88,4.75 27.12,4.75 29.25,6.88 30,6.88 v30,6.5
DOUT4  (via drill 0.3)
  Top 0.254: 34.62,4 v34.62,4.75 | 34.62,4 33.88,3.25 32.88,3.25 32.05,2.42 U$19.1 U$16.1 30.38,2.3 30.38,1.62 30.25,1.5 R11.1 | 34.62,4 35.12,3.5 36.25,3.5 36.42,3.33 U$20.2 U$23.2 39.95,3.33 40.5,3.88 41.5,3.88 41.62,4 41.62,5 41.88,5.25 U$22.7 | R13.2 v37.76,6.5 v37.75,6.5
  Bottom 0.254: v34.62,4.75 34.88,4.75 37,6.88 37.75,6.88 v37.75,6.5
DOUT5  (via drill 0.3)
  Top 0.254: R14.1 38,1.5 38.12,1.62 38.12,2.3 U$20.1 U$23.1 39.8,2.42 40.62,3.25 41.62,3.25 42.38,4 | 42.38,4 v42.38,4.75 | R16.2 v45.51,6.5 v45.5,6.5 | 42.38,4 42.88,3.5 44,3.5 44.17,3.33 U$24.2 U$27.2 47.7,3.33 48.25,3.88 49.25,3.88 49.38,4 49.38,5 49.62,5.25 U$26.7
  Bottom 0.254: v42.38,4.75 42.62,4.75 44.75,6.88 45.5,6.88 v45.5,6.5
DOUT6  (via drill 0.3)
  Top 0.254: 50.12,4 v50.12,4.75 | R19.2 v53.26,6.5 v53.25,6.5 | 50.12,4 49.38,3.25 48.38,3.25 47.55,2.42 U$27.1 U$24.1 45.88,2.3 45.88,1.62 45.75,1.5 R17.1 | 50.12,4 50.62,3.5 51.75,3.5 51.92,3.33 U$28.2 U$31.2 55.45,3.33 56,3.88 57,3.88 57.12,4 57.12,5 57.38,5.25 U$30.7
  Bottom 0.254: v50.12,4.75 50.38,4.75 52.5,6.88 53.25,6.88 v53.25,6.5
DOUT7  (via drill 0.3)
  Top 0.254: 57.88,4 v57.88,4.75 | R22.2 v61.01,6.5 v61,6.5 | 57.88,4 57.12,3.25 56.12,3.25 55.3,2.42 U$31.1 U$28.1 53.62,2.3 53.62,1.62 53.5,1.5 R20.1 | 57.88,4 58.38,3.5 59.5,3.5 59.67,3.33 U$32.2 U$35.2 63.2,3.33 63.75,3.88 64.75,3.88 64.88,4 64.88,5 65.12,5.25 65.12,6.46 U$34.7
  Bottom 0.254: v57.88,4.75 58.12,4.75 60.25,6.88 61,6.88 v61,6.5
DOUT8  (via drill 0.3)
  Top 0.254: U$38.7 72.88,6.46 72.88,5.25 72.62,5 72.62,4 72.5,3.88 71.5,3.88 70.95,3.33 U$39.2 U$36.2 67.42,3.33 67.25,3.5 66.12,3.5 65.62,4 | 65.62,4 v65.62,4.75 | 65.62,4 64.88,3.25 63.88,3.25 63.05,2.42 U$35.1 U$32.1 61.38,2.3 61.38,1.62 61.25,1.5 R23.1 | R25.2 v68.75,6.5
  Bottom 0.254: v65.62,4.75 65.88,4.75 68,6.88 68.75,6.88 v68.75,6.5
DOUT9  (via drill 0.3)
  Top 0.254: 73.38,4 v73.38,4.75 | 73.38,4 72.62,3.25 71.62,3.25 70.8,2.42 U$39.1 U$36.1 69.12,2.3 69.12,1.62 69,1.5 R26.1 | 73.38,4 73.88,3.5 75,3.5 75.17,3.33 U$40.2 U$43.2 78.7,3.33 79.25,3.88 80.25,3.88 80.38,4 80.38,5 80.62,5.25 80.62,6.46 U$42.7 | R28.2 v76.5,6.5
  Bottom 0.254: v73.38,4.75 73.62,4.75 75.75,6.88 76.5,6.88 v76.5,6.5
DOUT10  (via drill 0.3)
  Top 0.254: R29.1 76.75,1.5 76.88,1.62 76.88,2.3 U$40.1 U$43.1 78.55,2.42 79.38,3.25 80.38,3.25 81.12,4 | 81.12,4 v81.12,4.75 | 81.12,4 81.62,3.5 82.75,3.5 82.92,3.33 U$44.2 U$47.2 86.45,3.33 87,3.88 88,3.88 88.12,4 88.12,5 88.38,5.25 88.38,6.46 U$46.7 | R31.2 v84.25,6.5
  Bottom 0.254: v81.12,4.75 81.38,4.75 83.5,6.88 84.25,6.88 v84.25,6.5
DOUT11  (via drill 0.3)
  Top 0.254: 88.88,4 v88.88,4.75 | 88.88,4 88.12,3.25 87.12,3.25 86.3,2.42 U$47.1 U$44.1 84.62,2.3 84.62,1.62 84.5,1.5 R32.1 | 88.88,4 89.38,3.5 90.5,3.5 90.67,3.33 U$48.2 U$51.2 94.2,3.33 94.75,3.88 95.75,3.88 95.88,4 95.88,5 96.12,5.25 96.12,6.46 U$50.7 | R34.2 v92,6.5
  Bottom 0.254: v88.88,4.75 89.12,4.75 91.25,6.88 92,6.88 v92,6.5
DOUT12  (via drill 0.3)
  Top 0.254: 96.62,4 v96.62,4.75 | 96.62,4 95.88,3.25 94.88,3.25 94.05,2.42 U$51.1 U$48.1 92.38,2.3 92.38,1.62 92.25,1.5 R35.1 | 96.62,4 97.12,3.5 98.25,3.5 98.42,3.33 U$52.2 U$55.2 101.95,3.33 102.5,3.88 103.5,3.88 103.62,4 103.62,5 103.88,5.25 103.88,6.46 U$54.7 | R37.2 v99.75,6.5
  Bottom 0.254: v96.62,4.75 96.88,4.75 99,6.88 99.75,6.88 v99.75,6.5
DOUT13  (via drill 0.3)
  Top 0.254: 104.38,4 v104.38,4.75 | 104.38,4 103.62,3.25 102.62,3.25 101.8,2.42 U$55.1 U$52.1 100.12,2.3 100.12,1.62 100,1.5 R38.1 | 104.38,4 104.88,3.5 106,3.5 106.17,3.33 U$56.2 U$59.2 109.7,3.33 110.25,3.88 111.25,3.88 111.38,4 111.38,5 111.62,5.25 111.62,6.46 U$58.7 | R40.2 v107.5,6.5
  Bottom 0.254: v104.38,4.75 104.62,4.75 106.75,6.88 107.5,6.88 v107.5,6.5
DOUT14  (via drill 0.3)
  Top 0.254: 112.12,4 v112.12,4.75 | 112.12,4 111.38,3.25 110.38,3.25 109.55,2.42 U$59.1 U$56.1 107.88,2.3 107.88,1.62 107.75,1.5 R41.1 | 112.12,4 112.62,3.5 113.75,3.5 113.92,3.33 U$60.2 U$63.2 117.45,3.33 118,3.88 119,3.88 119.12,4 119.12,5 119.38,5.25 119.38,6.46 U$62.7 | R43.2 v115.25,6.5
  Bottom 0.254: v112.12,4.75 112.38,4.75 114.5,6.88 115.25,6.88 v115.25,6.5
DOUT15  (via drill 0.3)
  Top 0.254: 119.88,4 v119.88,4.75 | 119.88,4 119.12,3.25 118.12,3.25 117.3,2.42 U$63.1 U$60.1 115.62,2.3 115.62,1.62 115.5,1.5 R44.1 | 119.88,4 120.38,3.5 121.5,3.5 121.67,3.33 U$64.2 U$67.2 125.2,3.33 125.75,3.88 126.75,3.88 126.88,4 126.88,5 127.12,5.25 127.12,6.46 U$66.7 | R46.2 v123,6.5
  Bottom 0.254: v119.88,4.75 120.12,4.75 122.25,6.88 123,6.88 v123,6.5
DOUT16  (via drill 0.3)
  Top 0.254: 127.62,4 v127.62,4.75 | 127.62,4 126.88,3.25 125.88,3.25 125.05,2.42 U$67.1 U$64.1 123.38,2.3 123.38,1.62 123.25,1.5 R47.1 | 127.62,4 128.12,3.5 129.25,3.5 129.43,3.33 U$68.2 U$71.2 132.95,3.33 133.5,3.88 134.5,3.88 134.62,4 134.62,5 134.88,5.25 U$70.7 | R49.2 v130.75,6.5
  Bottom 0.254: v127.62,4.75 127.88,4.75 130,6.88 130.75,6.88 v130.75,6.5
DOUT17  (via drill 0.3)
  Top 0.254: 135.38,4 v135.38,4.75 | 135.38,4 134.62,3.25 133.62,3.25 132.8,2.42 U$71.1 U$68.1 131.12,2.3 131.12,1.62 131,1.5 R50.1 | 135.38,4 135.88,3.5 137,3.5 137.18,3.33 U$72.2 U$75.2 140.7,3.33 141.25,3.88 142.25,3.88 142.38,4 142.38,5 142.62,5.25 U$74.7 | R52.2 v138.5,6.5
  Bottom 0.254: v135.38,4.75 135.62,4.75 137.75,6.88 138.5,6.88 v138.5,6.5
DOUT18  (via drill 0.3)
  Top 0.254: 143.12,4 v143.12,4.75 | 143.12,4 142.38,3.25 141.38,3.25 140.55,2.42 U$75.1 U$72.1 138.88,2.3 138.88,1.62 138.75,1.5 R53.1 | 143.12,4 143.62,3.5 144.75,3.5 144.93,3.33 U$76.2 U$79.2 148.45,3.33 149,3.88 150,3.88 150.12,4 150.12,5 150.38,5.25 U$78.7 | R55.2 v146.25,6.5
  Bottom 0.254: v143.12,4.75 143.38,4.75 145.5,6.88 146.25,6.88 v146.25,6.5
DOUT19  (via drill 0.3)
  Top 0.254: 150.88,4 v150.88,4.75 | 150.88,4 150.12,3.25 149.12,3.25 148.3,2.42 U$79.1 U$76.1 146.62,2.3 146.62,1.62 146.5,1.5 R56.1 | 150.88,4 151.38,3.5 152.5,3.5 152.68,3.33 U$80.2 | R58.2 v154,6.5
  Bottom 0.254: v150.88,4.75 151.12,4.75 153.25,6.88 154,6.88 v154,6.5
DOUT20
  Top 0.254: U$80.1 154.38,2.3 154.38,1.62 154.25,1.5 R59.1
GND  (via drill 0.3)
  Top 0.254: U$2.6 4.38,4.37 v4.5,4.25 4.75,4.25 4.88,4.12 6.12,4.12 C2.2 6.78,4.22 OUT1.3 | IN1.3 0.85,4.22 0.88,4.25 1.25,4.25 1.62,4.62 2,4.62 v2.12,4.75 | 7.22,4.25 OUT1.3 | U$6.6 12.13,4.37 v12.25,4.25 12.5,4.25 12.62,4.12 13.88,4.12 C1.2 14.53,4.22 U$8.3 | 14.97,4.25 U$8.3 | v9.88,4.75 9.75,4.62 9.38,4.62 9,4.25 8.62,4.25 8.6,4.22 U$7.3 OUT1.3 | U$10.6 19.89,4.37 v20,4.25 20.25,4.25 20.38,4.12 21.62,4.12 C3.2 22.27,4.22 U$12.3 | 22.73,4.25 U$12.3 | v17.62,4.75 17.5,4.62 17.12,4.62 16.75,4.25 16.38,4.25 16.35,4.22 U$11.3 U$8.3 | U$14.6 27.64,4.37 v27.75,4.25 28,4.25 28.12,4.12 29.38,4.12 C4.2 30.02,4.22 U$16.3 | 30.48,4.25 U$16.3 | v25.38,4.75 25.25,4.62 24.88,4.62 24.5,4.25 24.12,4.25 24.1,4.22 U$15.3 U$12.3 | U$18.6 35.38,4.37 v35.5,4.25 35.75,4.25 35.88,4.12 37.12,4.12 C5.2 37.77,4.22 U$20.3 | 38.23,4.25 U$20.3 | v33.12,4.75 33,4.62 32.62,4.62 32.25,4.25 31.88,4.25 31.85,4.22 U$19.3 U$16.3 | U$22.6 43.13,4.37 v43.25,4.25 43.5,4.25 43.62,4.12 44.88,4.12 C6.2 45.52,4.22 U$24.3 | 45.98,4.25 U$24.3 | v40.88,4.75 40.75,4.62 40.38,4.62 40,4.25 39.62,4.25 39.6,4.22 U$23.3 U$20.3 | U$26.6 50.88,4.37 v51,4.25 51.25,4.25 51.38,4.12 52.62,4.12 C7.2 53.27,4.22 U$28.3 | 53.73,4.25 U$28.3 | v48.62,4.75 48.5,4.62 48.12,4.62 47.75,4.25 47.38,4.25 47.35,4.22 U$27.3 U$24.3 | U$30.6 58.63,4.37 v58.75,4.25 59,4.25 59.12,4.12 60.38,4.12 C8.2 61.02,4.22 U$32.3 | 61.48,4.25 U$32.3 | v56.38,4.75 56.25,4.62 55.88,4.62 55.5,4.25 55.12,4.25 55.1,4.22 U$31.3 U$28.3 | U$34.6 66.39,4.37 v66.5,4.25 66.75,4.25 66.88,4.12 68.12,4.12 C9.2 68.78,4.22 U$36.3 | 69.22,4.25 U$36.3 | v64.12,4.75 64,4.62 63.62,4.62 63.25,4.25 62.88,4.25 62.85,4.22 U$35.3 U$32.3
  Top 0.254: U$38.6 74.14,4.37 v74.25,4.25 74.5,4.25 74.62,4.12 75.88,4.12 C10.2 76.53,4.22 U$40.3 | 76.97,4.25 U$40.3 | v71.88,4.75 71.75,4.62 71.38,4.62 71,4.25 70.62,4.25 70.6,4.22 U$39.3 U$36.3 | U$42.6 81.89,4.37 v82,4.25 82.25,4.25 82.38,4.12 83.62,4.12 C11.2 84.28,4.22 U$44.3 | 84.72,4.25 U$44.3 | v79.62,4.75 79.5,4.62 79.12,4.62 78.75,4.25 78.38,4.25 78.35,4.22 U$43.3 U$40.3 | U$46.6 89.64,4.37 v89.75,4.25 90,4.25 90.12,4.12 91.38,4.12 C12.2 92.03,4.22 U$48.3 | 92.47,4.25 U$48.3 | v87.38,4.75 87.25,4.62 86.88,4.62 86.5,4.25 86.12,4.25 86.1,4.22 U$47.3 U$44.3 | U$50.6 97.39,4.37 v97.5,4.25 97.75,4.25 97.88,4.12 99.12,4.12 C13.2 99.78,4.22 U$52.3 | 100.22,4.25 U$52.3 | v95.12,4.75 95,4.62 94.62,4.62 94.25,4.25 93.88,4.25 93.85,4.22 U$51.3 U$48.3 | U$54.6 105.14,4.37 v105.25,4.25 105.5,4.25 105.62,4.12 106.88,4.12 C14.2 107.53,4.22 U$56.3 | 107.97,4.25 U$56.3 | v102.88,4.75 102.75,4.62 102.38,4.62 102,4.25 101.62,4.25 101.6,4.22 U$55.3 U$52.3 | U$58.6 112.89,4.37 v113,4.25 113.25,4.25 113.38,4.12 114.62,4.12 C15.2 115.28,4.22 U$60.3 | 115.72,4.25 U$60.3 | v110.62,4.75 110.5,4.62 110.12,4.62 109.75,4.25 109.38,4.25 109.35,4.22 U$59.3 U$56.3 | U$62.6 120.64,4.37 v120.75,4.25 121,4.25 121.12,4.12 122.38,4.12 C16.2 123.03,4.22 U$64.3 | 123.47,4.25 U$64.3 | v118.38,4.75 118.25,4.62 117.88,4.62 117.5,4.25 117.12,4.25 117.1,4.22 U$63.3 U$60.3 | U$66.6 128.38,4.37 v128.5,4.25 128.75,4.25 128.88,4.12 130.12,4.12 C17.2 130.78,4.22 U$68.3 | 131.22,4.25 U$68.3 | v126.12,4.75 126,4.62 125.62,4.62 125.25,4.25 124.88,4.25 124.85,4.22 U$67.3 U$64.3 | U$70.6 136.13,4.37 v136.25,4.25 136.5,4.25 136.62,4.12 137.88,4.12 C18.2 138.53,4.22 U$72.3
  Top 0.254: 138.97,4.25 U$72.3 | v133.88,4.75 133.75,4.62 133.38,4.62 133,4.25 132.62,4.25 132.6,4.22 U$71.3 U$68.3 | U$74.6 143.88,4.37 v144,4.25 144.25,4.25 144.38,4.12 145.62,4.12 C19.2 146.28,4.22 U$76.3 | 146.72,4.25 U$76.3 | v141.62,4.75 141.5,4.62 141.12,4.62 140.75,4.25 140.38,4.25 140.35,4.22 U$75.3 U$72.3 | U$78.6 151.63,4.37 v151.75,4.25 152,4.25 152.12,4.12 153.38,4.12 C20.2 154.03,4.22 U$80.3 154.47,4.25 | v149.38,4.75 149.25,4.62 148.88,4.62 148.5,4.25 148.12,4.25 148.1,4.22 U$79.3 U$76.3
  Bottom 0.254: v4.5,4.25 4.5,4 3.25,4 2.5,4.75 v2.12,4.75 | v12.25,4.25 12.25,4 11,4 10.25,4.75 v9.88,4.75 | v20,4.25 20,4 18.75,4 18,4.75 v17.62,4.75 | v27.75,4.25 27.75,4 26.5,4 25.75,4.75 v25.38,4.75 | v35.5,4.25 35.5,4 34.25,4 33.5,4.75 v33.12,4.75 | v43.25,4.25 43.25,4 42,4 41.25,4.75 v40.88,4.75 | v51,4.25 51,4 49.75,4 49,4.75 v48.62,4.75 | v58.75,4.25 58.75,4 57.5,4 56.75,4.75 v56.38,4.75 | v66.5,4.25 66.5,4 65.25,4 64.5,4.75 v64.12,4.75 | v74.25,4.25 74.25,4 73,4 72.25,4.75 v71.88,4.75 | v82,4.25 82,4 80.75,4 80,4.75 v79.62,4.75 | v89.75,4.25 89.75,4 88.5,4 87.75,4.75 v87.38,4.75 | v97.5,4.25 97.5,4 96.25,4 95.5,4.75 v95.12,4.75 | v105.25,4.25 105.25,4 104,4 103.25,4.75 v102.88,4.75 | v113,4.25 113,4 111.75,4 111,4.75 v110.62,4.75 | v120.75,4.25 120.75,4 119.5,4 118.75,4.75 v118.38,4.75 | v128.5,4.25 128.5,4 127.25,4 126.5,4.75 v126.12,4.75 | v136.25,4.25 136.25,4 135,4 134.25,4.75 v133.88,4.75 | v144,4.25 144,4 142.75,4 142,4.75 v141.62,4.75 | v151.75,4.25 151.75,4 150.5,4 149.75,4.75 v149.38,4.75
N$1
  Top 0.254: U$6.5 13.38,6.5 13.38,7 13.62,7.25 R1.1
  Top 0.406: 13.4,6.78 U$6.5
N$2
  Top 0.254: R2.2 13.63,1.5 U$6.4
N$3
  Top 0.254: R3.1 9.37,6.25 U$6.8
  Top 0.406: 9.6,6.78 U$6.8
N$4
  Top 0.254: U$2.5 5.62,6.5 5.62,7 5.88,7.25 R4.1
  Top 0.406: 5.66,6.78 U$2.5
N$5
  Top 0.254: R5.2 5.88,1.5 U$2.4
N$6
  Top 0.254: R6.1 1.62,6.25 U$2.8
  Top 0.406: 1.84,6.78 U$2.8
N$7
  Top 0.254: U$10.5 21.12,6.5 21.12,7 21.38,7.25 R7.1
  Top 0.406: 21.16,6.78 U$10.5
N$8
  Top 0.254: R8.2 21.38,1.5 U$10.4
N$9
  Top 0.254: R9.1 17.12,6.25 U$10.8
  Top 0.406: 17.34,6.78 U$10.8
N$10
  Top 0.254: U$14.5 28.88,6.5 28.88,7 29.12,7.25 R10.1
  Top 0.406: 28.91,6.78 U$14.5
N$11
  Top 0.254: R11.2 29.13,1.5 U$14.4
N$12
  Top 0.254: R12.1 24.87,6.25 U$14.8
  Top 0.406: 25.09,6.78 U$14.8
N$13
  Top 0.254: U$18.5 36.62,6.5 36.62,7 36.88,7.25 R13.1
  Top 0.406: 36.66,6.78 U$18.5
N$14
  Top 0.254: R14.2 36.88,1.5 U$18.4
N$15
  Top 0.254: R15.1 32.62,6.25 U$18.8
  Top 0.406: 32.84,6.78 U$18.8
N$16
  Top 0.254: U$22.5 44.38,6.5 44.38,7 44.62,7.25 R16.1
  Top 0.406: 44.41,6.78 U$22.5
N$17
  Top 0.254: R17.2 44.63,1.5 U$22.4
N$18
  Top 0.254: R18.1 40.37,6.25 U$22.8
  Top 0.406: 40.59,6.78 U$22.8
N$19
  Top 0.254: U$26.5 52.12,6.5 52.12,7 52.38,7.25 R19.1
  Top 0.406: 52.16,6.78 U$26.5
N$20
  Top 0.254: R20.2 52.38,1.5 U$26.4
N$21
  Top 0.254: R21.1 48.12,6.25 U$26.8
  Top 0.406: 48.34,6.78 U$26.8
N$22
  Top 0.254: U$30.5 59.88,6.5 59.88,7 60.12,7.25 R22.1
  Top 0.406: 59.91,6.78 U$30.5
N$23
  Top 0.254: R23.2 60.13,1.5 U$30.4
N$24
  Top 0.254: R24.1 55.87,6.25 U$30.8
  Top 0.406: 56.09,6.78 U$30.8
N$25
  Top 0.254: U$34.5 67.62,6.5 67.62,7 67.88,7.25 R25.1
  Top 0.406: 67.66,6.78 U$34.5
N$26
  Top 0.254: R26.2 67.88,1.5 U$34.4
N$27
  Top 0.254: R27.1 63.62,6.25 U$34.8
  Top 0.406: 63.84,6.78 U$34.8
N$28
  Top 0.254: U$38.5 75.38,6.5 75.38,7 75.62,7.25 R28.1
  Top 0.406: 75.41,6.78 U$38.5
N$29
  Top 0.254: R29.2 75.63,1.5 U$38.4
N$30
  Top 0.254: R30.1 71.37,6.25 U$38.8
  Top 0.406: 71.59,6.78 U$38.8
N$31
  Top 0.254: U$42.5 83.12,6.5 83.12,7 83.38,7.25 R31.1
  Top 0.406: 83.16,6.78 U$42.5
N$32
  Top 0.254: R32.2 83.38,1.5 U$42.4
N$33
  Top 0.254: R33.1 79.12,6.25 U$42.8
  Top 0.406: 79.34,6.78 U$42.8
N$34
  Top 0.254: U$46.5 90.88,6.5 90.88,7 91.12,7.25 R34.1
  Top 0.406: 90.91,6.78 U$46.5
N$35
  Top 0.254: R35.2 91.13,1.5 U$46.4
N$36
  Top 0.254: R36.1 86.87,6.25 U$46.8
  Top 0.406: 87.09,6.78 U$46.8
N$37
  Top 0.254: U$50.5 98.62,6.5 98.62,7 98.88,7.25 R37.1
  Top 0.406: 98.66,6.78 U$50.5
N$38
  Top 0.254: R38.2 98.88,1.5 U$50.4
N$39
  Top 0.254: R39.1 94.62,6.25 U$50.8
  Top 0.406: 94.84,6.78 U$50.8
N$40
  Top 0.254: U$54.5 106.38,6.5 106.38,7 106.62,7.25 R40.1
  Top 0.406: 106.41,6.78 U$54.5
N$41
  Top 0.254: R41.2 106.63,1.5 U$54.4
N$42
  Top 0.254: R42.1 102.37,6.25 U$54.8
  Top 0.406: 102.59,6.78 U$54.8
N$43
  Top 0.254: U$58.5 114.12,6.5 114.12,7 114.38,7.25 R43.1
  Top 0.406: 114.16,6.78 U$58.5
N$44
  Top 0.254: R44.2 114.38,1.5 U$58.4
N$45
  Top 0.254: R45.1 110.12,6.25 U$58.8
  Top 0.406: 110.34,6.78 U$58.8
N$46
  Top 0.254: U$62.5 121.88,6.5 121.88,7 122.12,7.25 R46.1
  Top 0.406: 121.91,6.78 U$62.5
N$47
  Top 0.254: R47.2 122.13,1.5 U$62.4
N$48
  Top 0.254: R48.1 117.87,6.25 U$62.8
  Top 0.406: 118.09,6.78 U$62.8
N$49
  Top 0.254: U$66.5 129.62,6.5 129.62,7 129.88,7.25 R49.1
  Top 0.406: 129.66,6.78 U$66.5
N$50
  Top 0.254: R50.2 129.88,1.5 U$66.4
N$51
  Top 0.254: R51.1 125.62,6.25 U$66.8
  Top 0.406: 125.84,6.78 U$66.8
N$52
  Top 0.254: U$70.5 137.38,6.5 137.38,7 137.62,7.25 R52.1
  Top 0.406: 137.41,6.78 U$70.5
N$53
  Top 0.254: R53.2 137.63,1.5 U$70.4
N$54
  Top 0.254: R54.1 133.37,6.25 U$70.8
  Top 0.406: 133.59,6.78 U$70.8
N$55
  Top 0.254: U$74.5 145.12,6.5 145.12,7 145.38,7.25 R55.1
  Top 0.406: 145.16,6.78 U$74.5
N$56
  Top 0.254: R56.2 145.38,1.5 U$74.4
N$57
  Top 0.254: R57.1 141.12,6.25 U$74.8
  Top 0.406: 141.34,6.78 U$74.8
N$58
  Top 0.254: U$78.5 152.88,6.5 152.88,7 153.12,7.25 R58.1
  Top 0.406: 152.91,6.78 U$78.5
N$59
  Top 0.254: R59.2 153.13,1.5 U$78.4
N$60
  Top 0.254: R60.1 148.87,6.25 U$78.8
  Top 0.406: 149.09,6.78 U$78.8
NEG_PAD1  (via drill 0.3)
  Top 0.254: U$2.1 U$2.2 U$2.3 4.75,1.64 v4.75,2.75
  Bottom 0.254: U$1.P$1 4.99,2.51 v4.75,2.75
NEG_PAD2  (via drill 0.3)
  Top 0.254: U$6.1 U$6.2 U$6.3 12.5,1.64 v12.5,2.75
  Bottom 0.254: U$5.P$1 12.74,2.51 v12.5,2.75
NEG_PAD3  (via drill 0.3)
  Top 0.254: U$10.1 U$10.2 U$10.3 20.25,1.64 v20.25,2.75
  Bottom 0.254: U$9.P$1 20.49,2.51 v20.25,2.75
NEG_PAD4  (via drill 0.3)
  Top 0.254: U$14.1 U$14.2 U$14.3 28,1.64 v28,2.75
  Bottom 0.254: U$13.P$1 28,1.32 v28,2.75
NEG_PAD5  (via drill 0.3)
  Top 0.254: U$18.1 U$18.2 U$18.3 35.38,1.39 35.75,1.75 | v35.75,2.75 35.75,1.75 | 35.75,1.75 35.75,1.64
  Bottom 0.254: U$17.P$1 35.99,2.51 v35.75,2.75
NEG_PAD6  (via drill 0.3)
  Top 0.254: U$22.1 U$22.2 U$22.3 43.5,1.64 v43.5,2.75
  Bottom 0.254: U$21.P$1 43.74,2.51 v43.5,2.75
NEG_PAD7  (via drill 0.3)
  Top 0.254: U$26.1 U$26.2 U$26.3 51.25,1.64 v51.25,2.75
  Bottom 0.254: U$25.P$1 51.49,2.51 v51.25,2.75
NEG_PAD8  (via drill 0.3)
  Top 0.254: U$30.1 U$30.2 U$30.3 59,1.64 v59,2.75
  Bottom 0.254: U$29.P$1 59.24,2.51 v59,2.75
NEG_PAD9  (via drill 0.3)
  Top 0.254: U$34.1 U$34.2 U$34.3 66.75,1.64 v66.75,2.75
  Bottom 0.254: U$33.P$1 66.99,2.51 v66.75,2.75
NEG_PAD10  (via drill 0.3)
  Top 0.254: U$38.1 U$38.2 U$38.3 74.5,1.64 v74.5,2.75
  Bottom 0.254: U$37.P$1 74.74,2.51 v74.5,2.75
NEG_PAD11  (via drill 0.3)
  Top 0.254: U$42.1 U$42.2 U$42.3 82.25,1.64 v82.25,2.75
  Bottom 0.254: U$41.P$1 82.49,2.51 v82.25,2.75
NEG_PAD12  (via drill 0.3)
  Top 0.254: U$46.1 U$46.2 U$46.3 90,1.64 v90,2.75
  Bottom 0.254: U$45.P$1 90.24,2.51 v90,2.75
NEG_PAD13  (via drill 0.3)
  Top 0.254: U$50.1 U$50.2 U$50.3 97.75,1.64 v97.75,2.75
  Bottom 0.254: U$49.P$1 97.99,2.51 v97.75,2.75
NEG_PAD14  (via drill 0.3)
  Top 0.254: U$54.1 U$54.2 U$54.3 105.5,1.64 v105.5,2.75
  Bottom 0.254: U$53.P$1 105.74,2.51 v105.5,2.75
NEG_PAD15  (via drill 0.3)
  Top 0.254: U$58.1 U$58.2 U$58.3 113.25,1.64 v113.25,2.75
  Bottom 0.254: U$57.P$1 113.49,2.51 v113.25,2.75
NEG_PAD16  (via drill 0.3)
  Top 0.254: U$62.1 U$62.2 U$62.3 121,1.64 v121,2.75
  Bottom 0.254: U$61.P$1 121.24,2.51 v121,2.75
NEG_PAD17  (via drill 0.3)
  Top 0.254: U$66.1 U$66.2 U$66.3 128.75,1.64 v128.75,2.75
  Bottom 0.254: U$65.P$1 128.99,2.51 v128.75,2.75
NEG_PAD18  (via drill 0.3)
  Top 0.254: U$70.1 U$70.2 U$70.3 136.5,1.64 v136.5,2.75
  Bottom 0.254: U$69.P$1 136.74,2.51 v136.5,2.75
NEG_PAD19  (via drill 0.3)
  Top 0.254: U$74.1 U$74.2 U$74.3 144.25,1.64 v144.25,2.75
  Bottom 0.254: U$73.P$1 144.49,2.51 v144.25,2.75
NEG_PAD20  (via drill 0.3)
  Top 0.254: U$78.1 U$78.2 U$78.3 152,1.64 v152,2.75
  Bottom 0.254: U$77.P$1 152.24,2.51 v152,2.75
VCC  (via drill 0.3)
  Top 0.254: R6.2 0.5,6.25 | 0.5,6.25 0.5,6.75 v0.88,7.12 | IN1.4 0.5,6.25 | v5.25,4.88 5.38,5 C2.1 6.62,5.12 OUT1.4 U$7.4 8.25,6.25 | R3.2 8.25,6.25 | 8.25,6.25 8.25,6.75 v8.62,7.12 | v13,4.88 13.12,5 C1.1 14.38,5.12 U$8.4 U$11.4 16,6.25 | R9.2 16,6.25 | 16,6.25 16,6.75 v16.38,7.12 | v20.75,4.88 20.88,5 C3.1 22.12,5.12 U$12.4 U$15.4 23.75,6.25 | R12.2 23.75,6.25 | 23.75,6.25 23.75,6.75 v24.12,7.12 | v28.5,4.88 28.62,5 C4.1 29.88,5.12 U$16.4 U$19.4 31.5,6.25 | R15.2 31.5,6.25 | 31.5,6.25 31.5,6.75 v31.88,7.12 | v36.25,4.88 36.38,5 C5.1 37.62,5.12 U$20.4 U$23.4 39.25,6.25 | R18.2 39.25,6.25 | 39.25,6.25 39.25,6.75 v39.62,7.12 | v44,4.88 44.12,5 C6.1 45.38,5.12 U$24.4 U$27.4 47,6.25 | R21.2 47,6.25 | 47,6.25 47,6.75 v47.38,7.12 | v51.75,4.88 51.88,5 C7.1 53.12,5.12 U$28.4 U$31.4 54.75,6.25 | R24.2 54.75,6.25 | 54.75,6.25 54.75,6.75 v55.12,7.12 | v59.5,4.88 59.62,5 C8.1 60.88,5.12 U$32.4 U$35.4 62.5,6.25 | R27.2 62.5,6.25 | 62.5,6.25 62.5,6.75 v62.88,7.12 | v67.25,4.88 67.38,5 C9.1 68.62,5.12 U$36.4 U$39.4 70.25,6.25 | R30.2 70.25,6.25 | 70.25,6.25 70.25,6.75 v70.62,7.12 | v75,4.88 75.12,5 C10.1 76.38,5.12 U$40.4 U$43.4 78,6.25 | R33.2 78,6.25 | 78,6.25 78,6.75 v78.38,7.12 | v82.75,4.88 82.88,5 C11.1 84.12,5.12 U$44.4 U$47.4 85.75,6.25 | R36.2 85.75,6.25 | 85.75,6.25 85.75,6.75 v86.12,7.12 | v90.5,4.88 90.62,5 C12.1 91.88,5.12 U$48.4 U$51.4 93.5,6.25 | R39.2 93.5,6.25 | 93.5,6.25 93.5,6.75 v93.88,7.12 | v98.25,4.88 98.38,5 C13.1 99.62,5.12 U$52.4 U$55.4 101.25,6.25 | R42.2 101.25,6.25 | 101.25,6.25 101.25,6.75 v101.62,7.12 | v106,4.88 106.12,5 C14.1 107.38,5.12 U$56.4 U$59.4 109,6.25 | R45.2 109,6.25 | 109,6.25 109,6.75 v109.38,7.12
  Top 0.254: v113.75,4.88 113.88,5 C15.1 115.12,5.12 U$60.4 U$63.4 116.75,6.25 | R48.2 116.75,6.25 | 116.75,6.25 116.75,6.75 v117.12,7.12 | v121.5,4.88 121.62,5 C16.1 122.88,5.12 U$64.4 U$67.4 124.5,6.25 | R51.2 124.5,6.25 | 124.5,6.25 124.5,6.75 v124.88,7.12 | v129.25,4.88 129.38,5 C17.1 130.62,5.12 U$68.4 U$71.4 132.25,6.25 | R54.2 132.25,6.25 | 132.25,6.25 132.25,6.75 v132.62,7.12 | v137,4.88 137.12,5 C18.1 138.38,5.12 U$72.4 U$75.4 140,6.25 | R57.2 140,6.25 | 140,6.25 140,6.75 v140.38,7.12 | v144.75,4.88 144.88,5 C19.1 146.12,5.12 U$76.4 U$79.4 147.75,6.25 | U$80.4 153.88,5.12 C20.1 152.62,5 v152.5,4.88 | R60.2 147.75,6.25 | 147.75,6.25 147.75,6.75 v148.12,7.12
  Bottom 0.254: v0.88,7.12 0.88,6.12 1.38,5.62 1.38,2.46 U$1.P$2 2.5,2.75 3.25,3.5 5,3.5 5.25,3.75 v5.25,4.88 | v8.62,7.12 8.62,6.12 9.12,5.62 9.12,2.46 U$5.P$2 10.25,2.75 11,3.5 12.75,3.5 13,3.75 v13,4.88 | v16.38,7.12 16.38,6.12 16.88,5.62 16.88,2.46 U$9.P$2 18,2.75 18.75,3.5 20.5,3.5 20.75,3.75 v20.75,4.88 | v24.12,7.12 24.12,6.12 24.62,5.62 24.62,2.46 U$13.P$2 25.75,2.75 26.5,3.5 28.25,3.5 28.5,3.75 v28.5,4.88 | v31.88,7.12 31.88,6.12 32.38,5.62 32.38,2.46 U$17.P$2 33.5,2.75 34.25,3.5 36,3.5 36.25,3.75 v36.25,4.88 | v39.62,7.12 39.62,6.12 40.12,5.62 40.12,2.46 U$21.P$2 41.25,2.75 42,3.5 43.75,3.5 44,3.75 v44,4.88 | v47.38,7.12 47.38,6.12 47.88,5.62 47.88,2.46 U$25.P$2 49,2.75 49.75,3.5 51.5,3.5 51.75,3.75 v51.75,4.88 | v55.12,7.12 55.12,6.12 55.62,5.62 55.62,2.46 U$29.P$2 56.75,2.75 57.5,3.5 59.25,3.5 59.5,3.75 v59.5,4.88 | v62.88,7.12 62.88,6.12 63.38,5.62 63.38,2.46 U$33.P$2 64.5,2.75 65.25,3.5 67,3.5 67.25,3.75 v67.25,4.88 | v70.62,7.12 70.62,6.12 71.12,5.62 71.12,2.46 U$37.P$2 72.25,2.75 73,3.5 74.75,3.5 75,3.75 v75,4.88 | v78.38,7.12 78.38,6.12 78.88,5.62 78.88,2.46 U$41.P$2 80,2.75 80.75,3.5 82.5,3.5 82.75,3.75 v82.75,4.88 | v86.12,7.12 86.12,6.12 86.62,5.62 86.62,2.46 U$45.P$2 87.75,2.75 88.5,3.5 90.25,3.5 90.5,3.75 v90.5,4.88 | v93.88,7.12 93.88,6.12 94.38,5.62 94.38,2.46 U$49.P$2 95.5,2.75 96.25,3.5 98,3.5 98.25,3.75 v98.25,4.88 | v101.62,7.12 101.62,6.12 102.12,5.62 102.12,2.46 U$53.P$2 103.25,2.75 104,3.5 105.75,3.5 106,3.75 v106,4.88 | v109.38,7.12 109.38,6.12 109.88,5.62 109.88,2.46 U$57.P$2 111,2.75 111.75,3.5 113.5,3.5 113.75,3.75 v113.75,4.88
  Bottom 0.254: v117.12,7.12 117.12,6.12 117.62,5.62 117.62,2.46 U$61.P$2 118.75,2.75 119.5,3.5 121.25,3.5 121.5,3.75 v121.5,4.88 | v124.88,7.12 124.88,6.12 125.38,5.62 125.38,2.46 U$65.P$2 126.5,2.75 127.25,3.5 129,3.5 129.25,3.75 v129.25,4.88 | v132.62,7.12 132.62,6.12 133.12,5.62 133.12,2.46 U$69.P$2 134.25,2.75 135,3.5 136.75,3.5 137,3.75 v137,4.88 | v140.38,7.12 140.38,6.12 140.88,5.62 140.88,2.46 U$73.P$2 142,2.75 142.75,3.5 144.5,3.5 144.75,3.75 v144.75,4.88 | v148.12,7.12 148.12,6.12 148.62,5.62 148.62,2.46 U$77.P$2 149.75,2.75 150.5,3.5 152.25,3.5 152.5,3.75 v152.5,4.88